# EasyEDA Pro project Connective.eprj, board PCB1
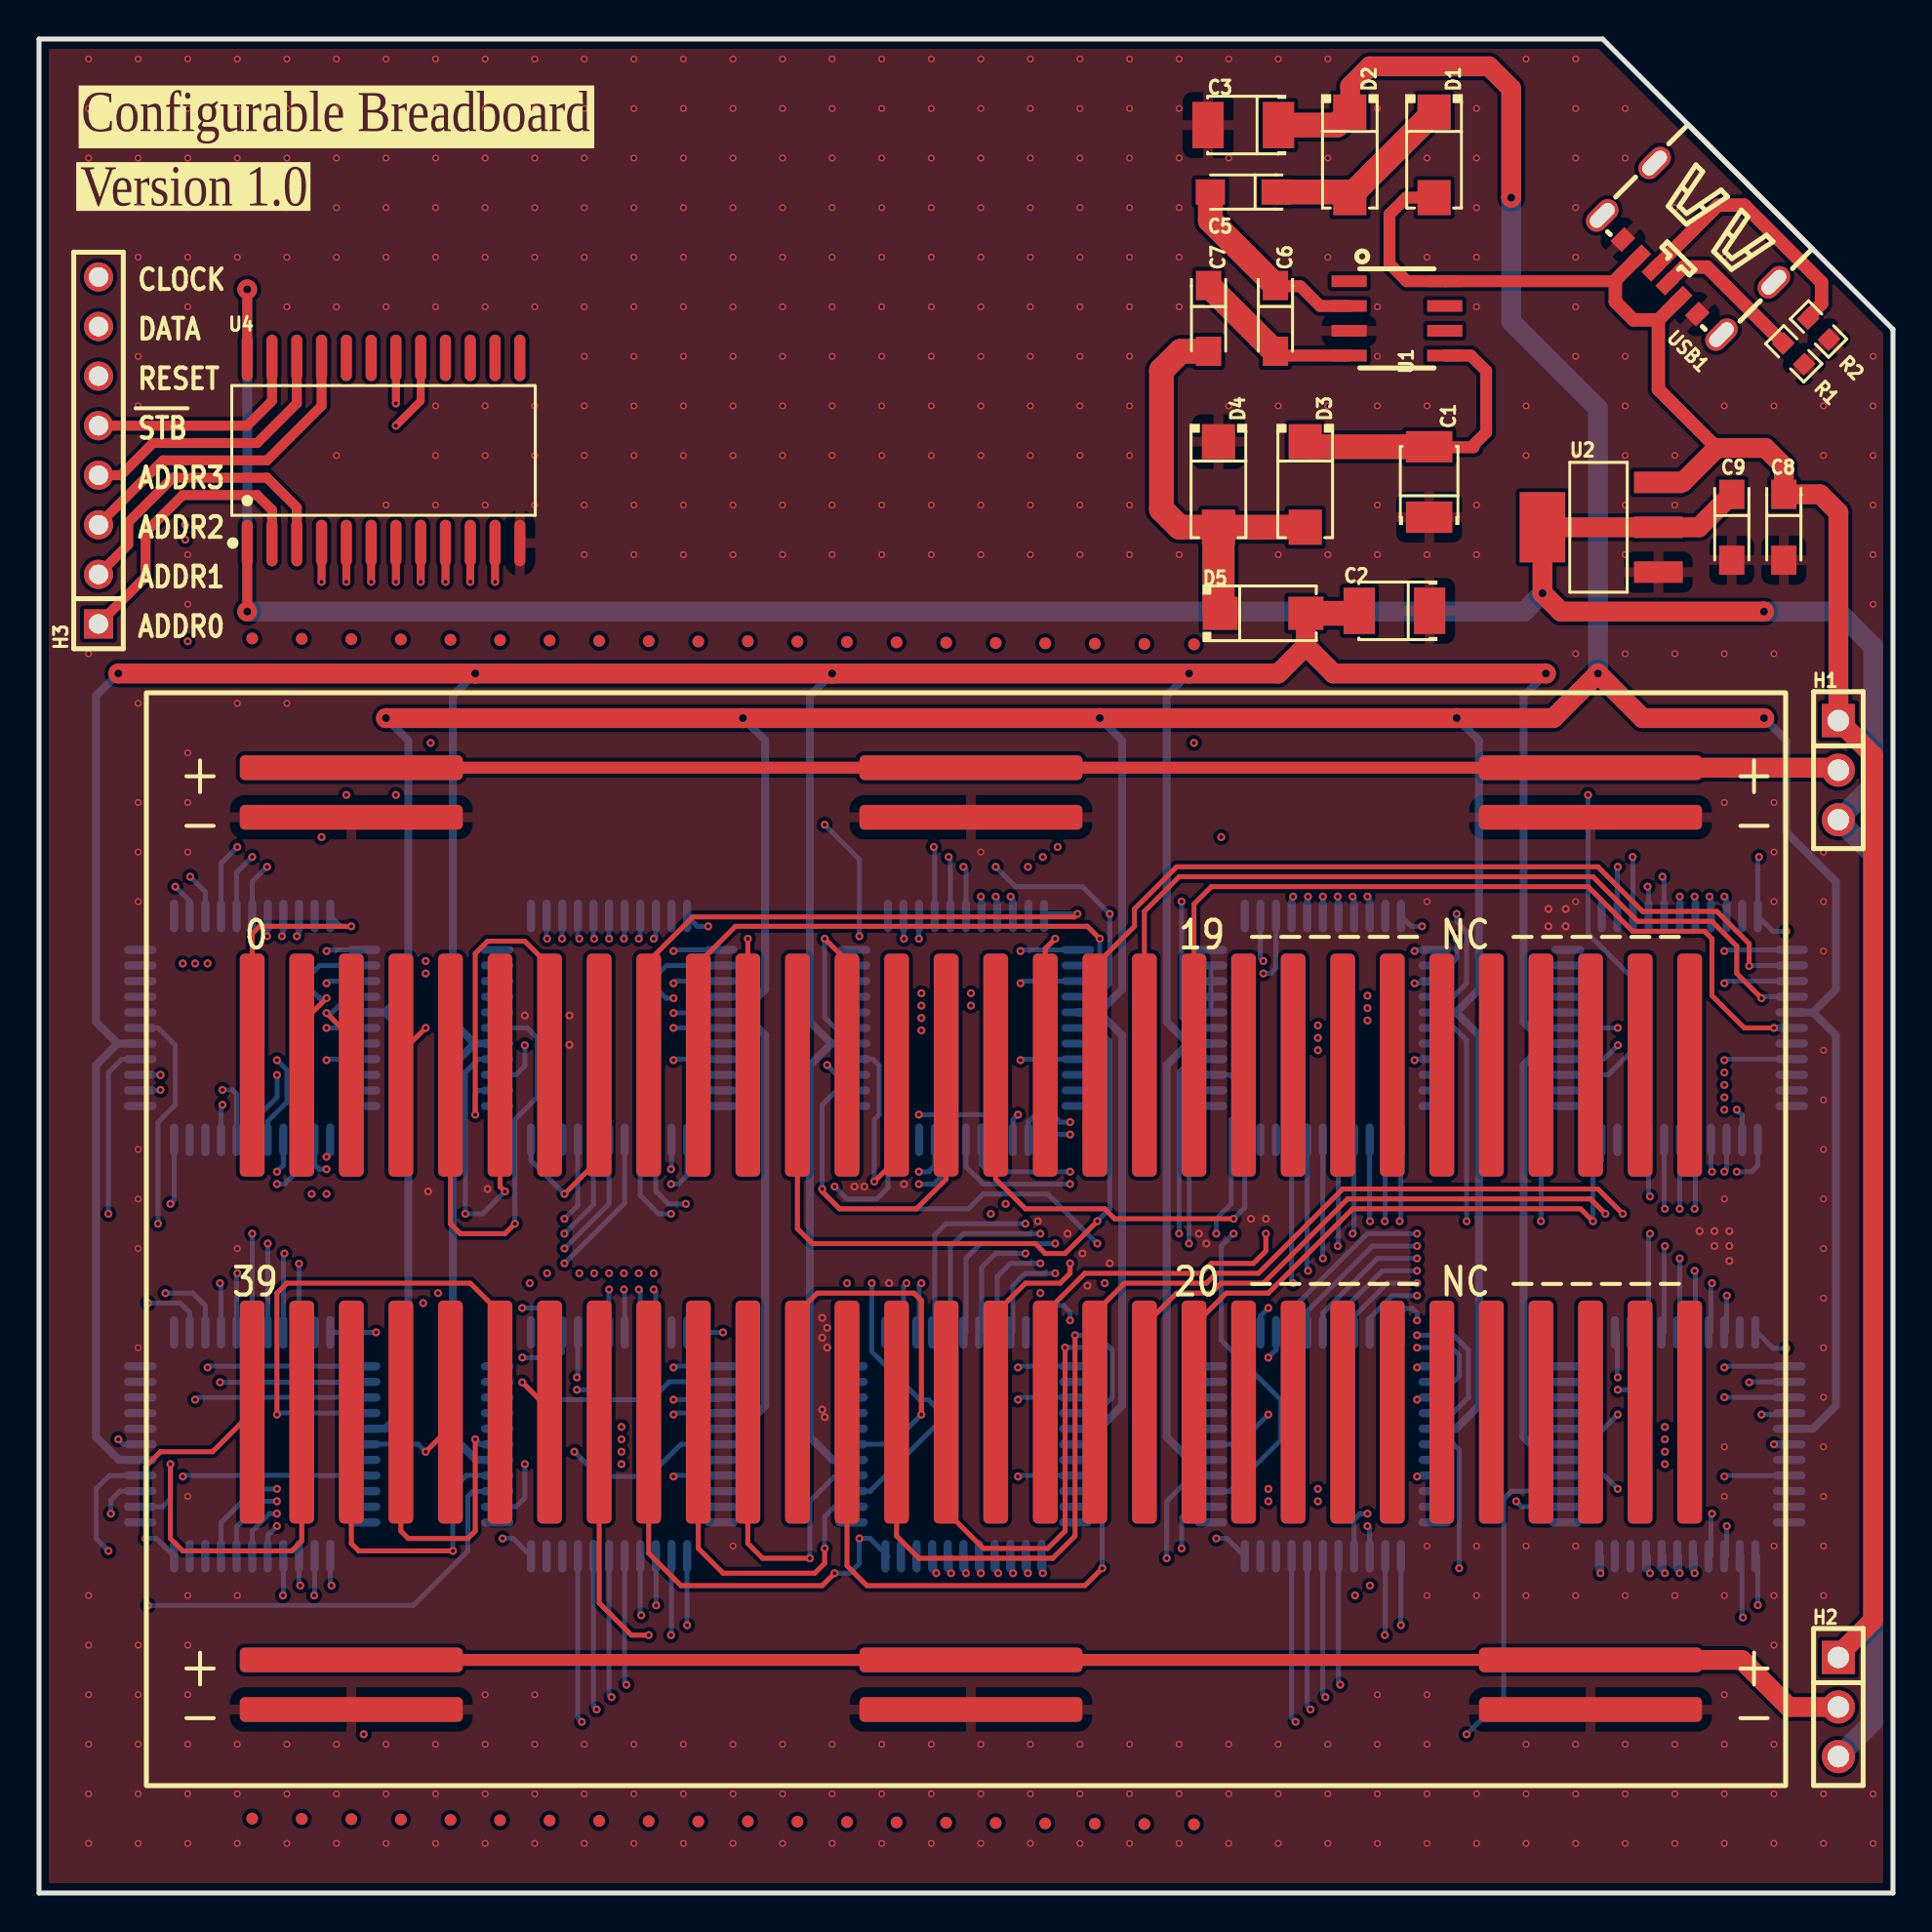
[diagram p1: board, top side]
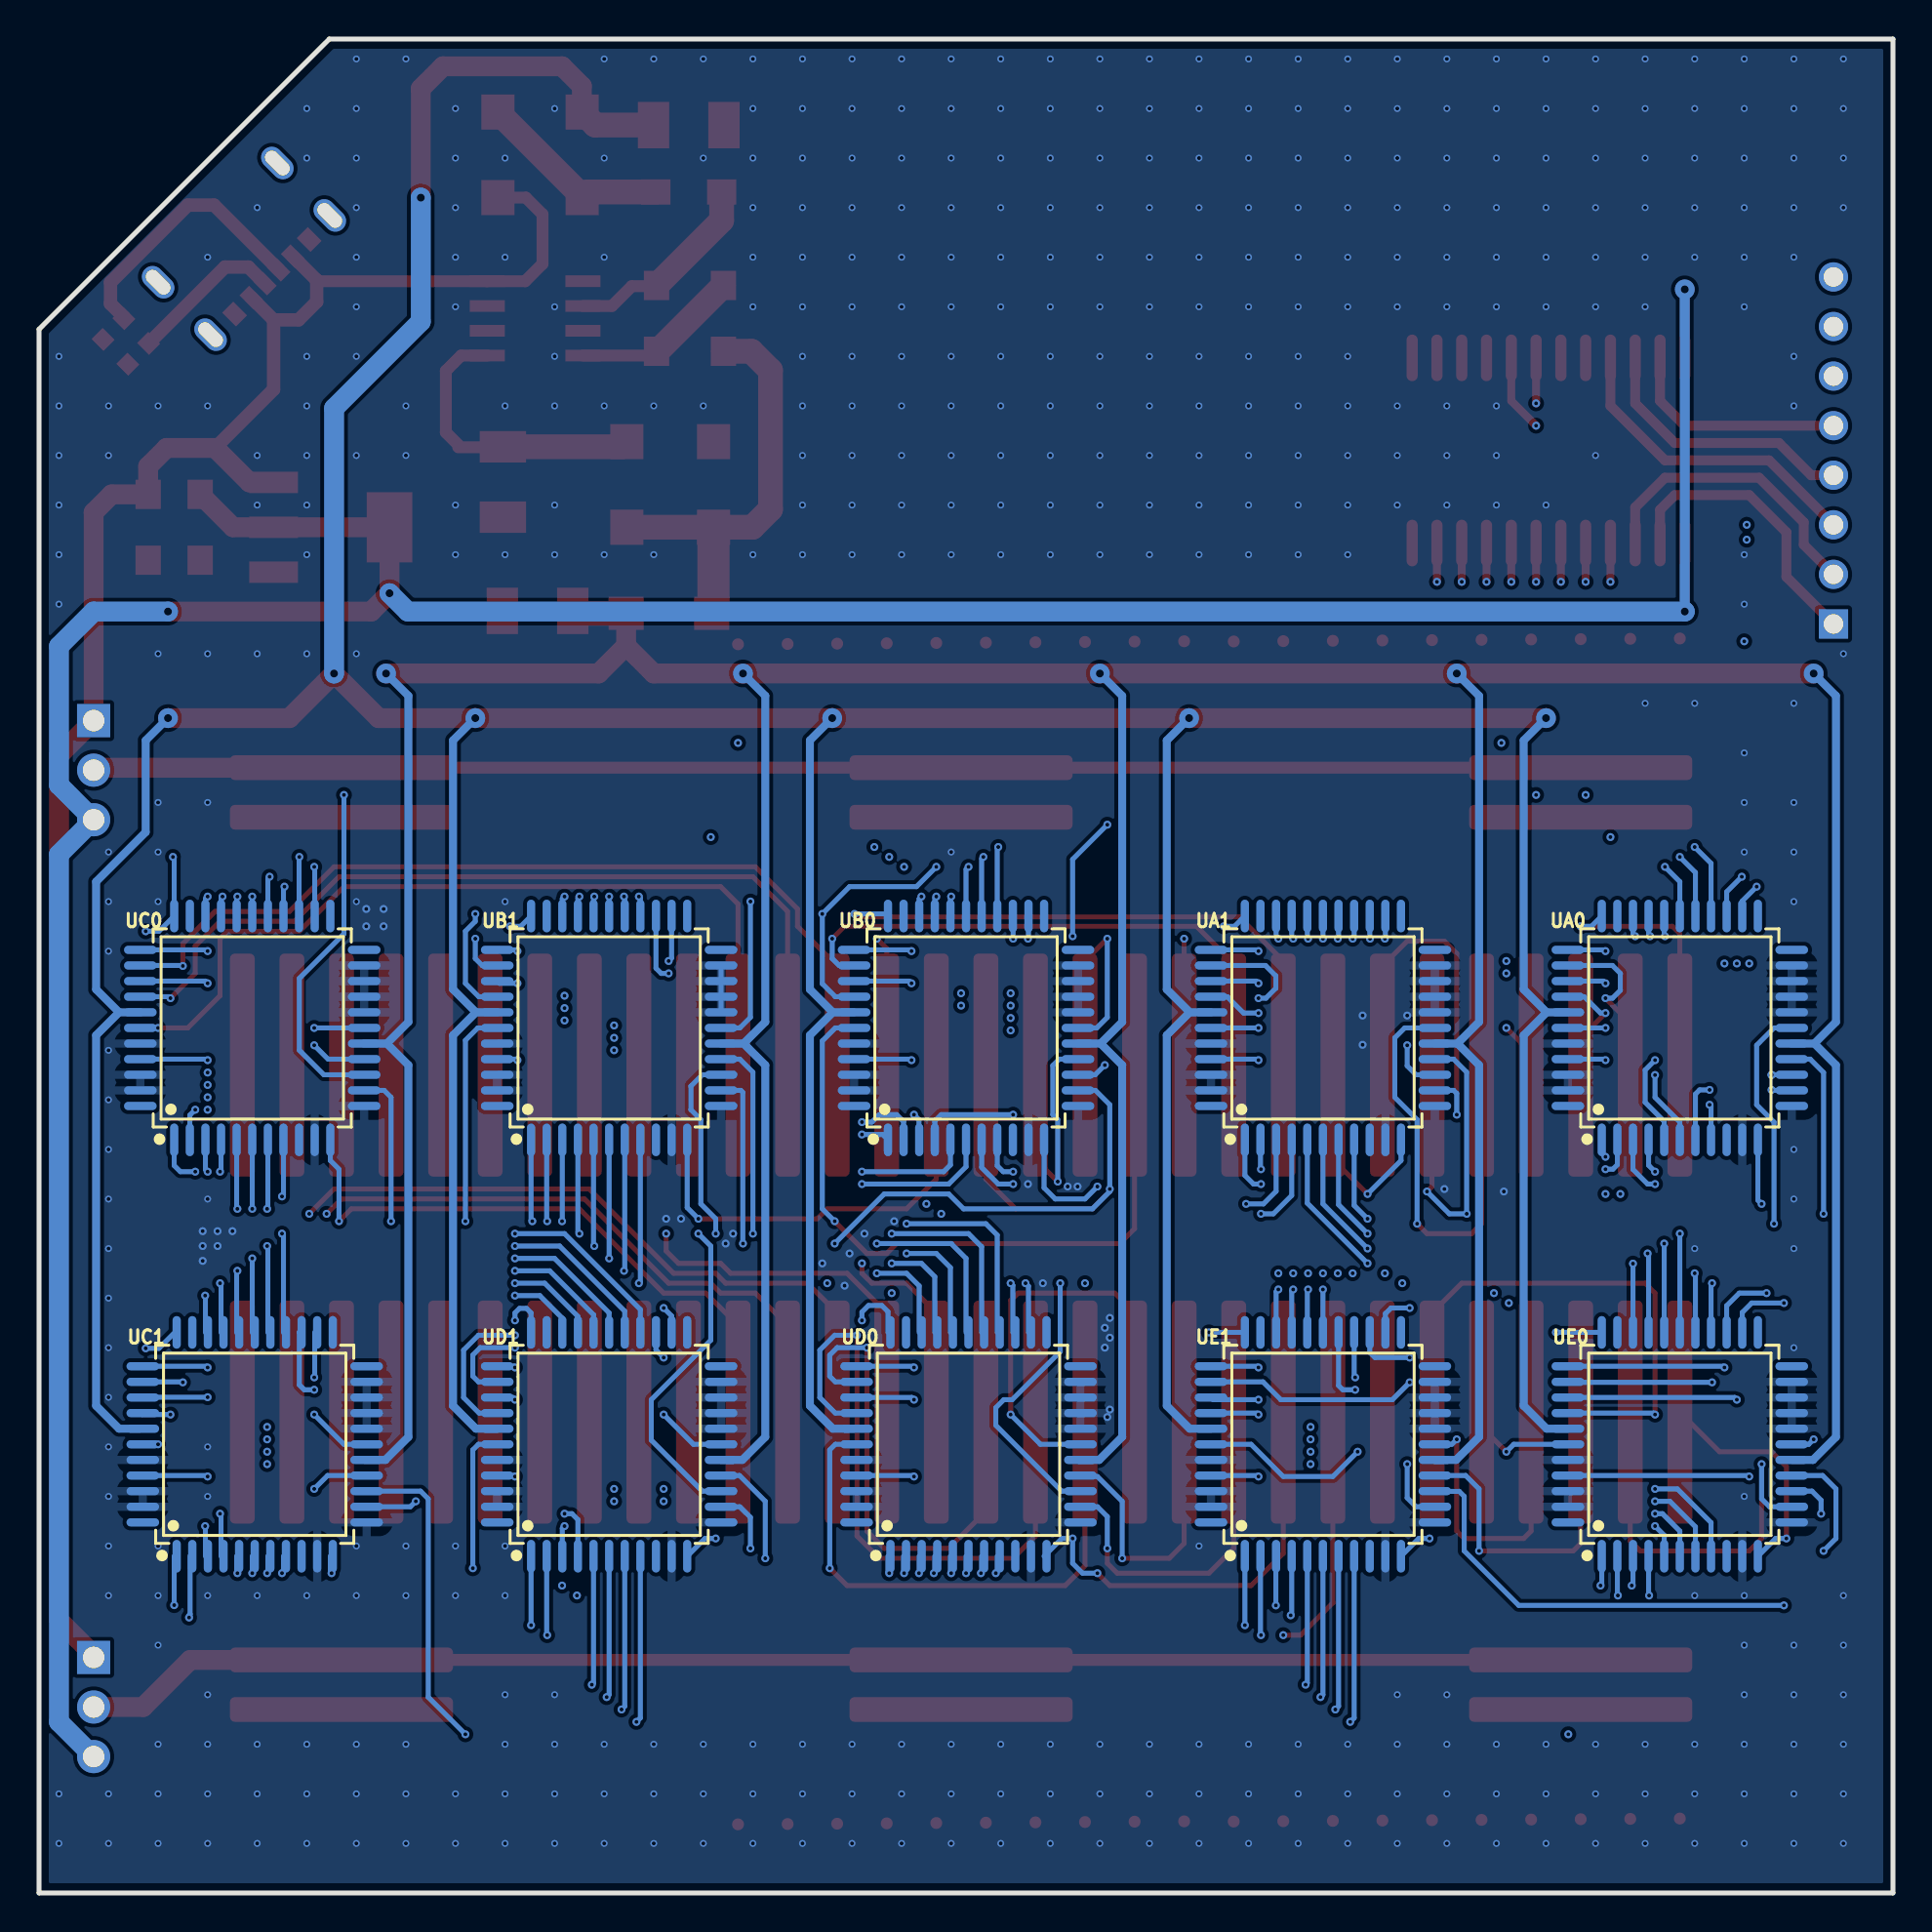
[diagram p2: board, bottom side, seen from below]

Outline 95 x 95 mm; copper layers: Top Layer, Inner1, Inner2, Bottom Layer. Coordinates in mm from the lower left corner of the outline.
Outline path: 0,95 0,0 95,0 95,80.12 80.12,95 0,95
Stack: Top Layer 0.035mm 外层铜厚1oz / Dielectric1 0.2104mm 7628 RC49% 8.6mil / Inner1 0.0152mm 内层铜厚 / Dielectric2 1.065mm 1.1mm H/HOZ 含铜 / Inner2 0.0152mm 内层铜厚 / Dielectric3 0.2104mm 7628 RC49% 8.6mil / Bottom Layer 0.035mm 外层铜厚1oz

## Design rules (mm)
template: 自定义配置
spacing copperThickness1oz (default): track to track 0.102, other pairs 0.152 to 0.3
spacing copperThickness2oz: track to track 0.203, other pairs 0.152 to 0.3
track width copperThickness1oz (default): min 0.127, default 0.254, max 2.54
track width copperThickness2oz: min 0.203, default 0.254, max 2.54
differential pair differentialPair (default): width min 0.127, default 0.254, max 2.54; gap min 0.152, default 0.152
via viaSize (default): diameter min 0.254, default 0.356, max 10; hole min 0.203, default 0.203, max 6.299

## Placement (name value [footprint] x y rotation side)
C1  100uF  [CAP-SMD_L3.5-W2.8]  71.23 72.3 270 top
C2  100uF  [CAP-SMD_L3.5-W2.8]  69.45 65.7 0 top
C3  100uF  [CAP-SMD_L3.5-W2.8]  61.71 90.59 0 top
C5  10uF  [CAP-SMD_L3.2-W1.6-RD]  61.71 87.16 180 top
C6  10uF  [CAP-SMD_L3.2-W1.6-RD]  63.36 80.69 270 top
C7  10uF  [CAP-SMD_L3.2-W1.6-RD]  59.93 80.69 270 top
C8  10uF  [CAP-SMD_L3.2-W1.6-RD]  89.41 69.98 270 top
C9  10uF  [CAP-SMD_L3.2-W1.6-RD]  86.74 69.98 270 top
D1  1N5819  [SMA_L4.4-W2.6-LS5.0-RD]  71.49 89.07 270 top
D2  1N5819  [SMA_L4.4-W2.6-LS5.0-RD]  67.17 89.07 270 top
D3  1N5819  [SMA_L4.4-W2.6-LS5.0-RD]  64.88 72.18 270 top
D4  1N5819  [SMA_L4.4-W2.6-LS5.0-RD]  60.44 72.18 270 top
D5  1N5819  [SMA_L4.4-W2.6-LS5.0-RD]  62.72 65.57 0 top
H1  PZ254V-11-03P  [HDR-TH_3P-P2.54-V-M]  92.2 57.53 270 top
H2  PZ254V-11-03P  [HDR-TH_3P-P2.54-V-M]  92.2 9.53 270 top
H3  PZ254V-11-08P  [HDR-TH_8P-P2.54-V-M]  3.05 73.92 90 top
NOREF  -  [Pad_e109]  23.62 3.73 0 top
NOREF#2  -  [Pad_e624]  33.78 24.64 180 top
NOREF#3  -  [Pad_e619]  46.48 24.64 180 top
NOREF#4  -  [Pad_e639]  16 9.4 90 top
NOREF#5  -  [Pad_e84]  51.56 3.57 0 top
NOREF#6  -  [Pad_e587]  51.56 42.42 0 top
NOREF#7  -  [Pad_e638]  47.75 57.66 90 top
NOREF#8  -  [Pad_e34]  10.92 64.28 0 top
NOREF#9  -  [Pad_e611]  13.46 24.64 180 top
NOREF#10  -  [Pad_e134]  13.46 3.8 0 top
NOREF#11  -  [Pad_e76]  56.64 3.53 0 top
NOREF#12  -  [Pad_e39]  18.54 64.23 0 top
NOREF#13  -  [Pad_e568]  13.46 42.42 0 top
NOREF#14  -  [Pad_e634]  79.5 57.66 90 top
NOREF#15  -  [Pad_e597]  76.96 42.42 0 top
NOREF#16  -  [Pad_e111]  18.54 3.76 0 top
NOREF#17  -  [Pad_e86]  49.02 3.58 0 top
NOREF#18  -  [Pad_e40]  21.08 64.21 0 top
NOREF#19  -  [Pad_e621]  38.86 24.64 180 top
NOREF#20  -  [Pad_e640]  16 11.94 90 top
NOREF#21  -  [Pad_e588]  56.64 42.42 0 top
NOREF#22  -  [Pad_e605]  71.88 24.64 0 top
NOREF#23  -  [Pad_e602]  64.26 24.64 0 top
NOREF#24  -  [Pad_e133]  16 3.78 0 top
NOREF#25  -  [Pad_e580]  33.78 42.42 0 top
NOREF#26  -  [Pad_e87]  46.48 3.6 0 top
NOREF#27  -  [Pad_e632]  16 57.66 90 top
NOREF#28  -  [Pad_e592]  64.26 42.42 0 top
NOREF#29  -  [Pad_e582]  38.86 42.42 0 top
NOREF#30  -  [Pad_e57]  43.94 64.09 0 top
NOREF#31  -  [Pad_e59]  38.86 64.12 0 top
NOREF#32  -  [Pad_e77]  54.1 3.55 0 top
NOREF#33  -  [Pad_e579]  28.7 42.42 0 top
NOREF#34  -  [Pad_e52]  54.1 64.02 0 top
NOREF#35  -  [Pad_e625]  31.24 24.64 180 top
NOREF#36  -  [Pad_e45]  33.78 64.13 0 top
NOREF#37  -  [Pad_e35]  13.46 64.27 0 top
NOREF#38  -  [Pad_e623]  36.32 24.64 180 top
NOREF#39  -  [Pad_e618]  49.02 24.64 180 top
NOREF#40  -  [Pad_e627]  28.7 24.64 180 top
NOREF#41  -  [Pad_e630]  18.54 24.64 180 top
NOREF#42  -  [Pad_e614]  59.18 24.64 180 top
NOREF#43  -  [Pad_e50]  56.64 64 0 top
NOREF#44  -  [Pad_e604]  66.8 24.64 0 top
NOREF#45  -  [Pad_e642]  79.5 11.94 90 top
NOREF#46  -  [Pad_e612]  16 24.64 180 top
NOREF#47  -  [Pad_e600]  84.58 42.42 0 top
NOREF#48  -  [Pad_e620]  43.94 24.64 180 top
NOREF#49  -  [Pad_e589]  54.1 42.42 0 top
NOREF#50  -  [Pad_e60]  36.32 64.14 0 top
NOREF#51  -  [Pad_e42]  26.16 64.18 0 top
NOREF#52  -  [Pad_e617]  54.1 24.64 180 top
NOREF#53  -  [Pad_e607]  76.96 24.64 0 top
NOREF#54  -  [Pad_e581]  36.32 42.42 0 top
NOREF#55  -  [Pad_e590]  59.18 42.42 0 top
NOREF#56  -  [Pad_e110]  21.08 3.75 0 top
NOREF#57  -  [Pad_e591]  61.72 42.42 0 top
NOREF#58  -  [Pad_e615]  56.64 24.64 180 top
NOREF#59  -  [Pad_e577]  26.16 42.42 0 top
NOREF#60  -  [Pad_e102]  33.78 3.66 0 top
NOREF#61  -  [Pad_e58]  41.4 64.11 0 top
NOREF#62  -  [Pad_e37]  16 64.25 0 top
NOREF#63  -  [Pad_e569]  16 42.42 0 top
NOREF#64  -  [Pad_e637]  47.75 55.12 90 top
NOREF#65  -  [Pad_e98]  41.4 3.64 0 top
NOREF#66  -  [Pad_e43]  28.7 64.16 0 top
NOREF#67  -  [Pad_e606]  74.42 24.64 0 top
NOREF#68  -  [Pad_e44]  31.24 64.15 0 top
NOREF#69  -  [Pad_e103]  31.24 3.68 0 top
NOREF#70  -  [Pad_e566]  10.92 42.42 0 top
NOREF#71  -  [Pad_e100]  38.86 3.65 0 top
NOREF#72  -  [Pad_e108]  26.16 3.71 0 top
NOREF#73  -  [Pad_e584]  41.4 42.42 0 top
NOREF#74  -  [Pad_e644]  47.75 11.94 90 top
NOREF#75  -  [Pad_e575]  21.08 42.42 0 top
NOREF#76  -  [Pad_e610]  84.58 24.64 0 top
NOREF#77  -  [Pad_e628]  23.62 24.64 180 top
NOREF#78  -  [Pad_e598]  82.04 42.42 0 top
NOREF#79  -  [Pad_e89]  43.94 3.62 0 top
NOREF#80  -  [Pad_e101]  36.32 3.67 0 top
NOREF#81  -  [Pad_e75]  59.18 3.52 0 top
NOREF#82  -  [Pad_e74]  59.18 63.98 0 top
NOREF#83  -  [Pad_e576]  23.62 42.42 0 top
NOREF#84  -  [Pad_e616]  51.56 24.64 180 top
NOREF#85  -  [Pad_e622]  41.4 24.64 180 top
NOREF#86  -  [Pad_e643]  47.75 9.4 90 top
NOREF#87  -  [Pad_e570]  18.54 42.42 0 top
NOREF#88  -  [Pad_e594]  66.8 42.42 0 top
NOREF#89  -  [Pad_e599]  79.5 42.42 0 top
NOREF#90  -  [Pad_e613]  10.92 24.64 180 top
NOREF#91  -  [Pad_e586]  49.02 42.42 0 top
NOREF#92  -  [Pad_e56]  46.48 64.07 0 top
NOREF#93  -  [Pad_e626]  26.16 24.64 180 top
NOREF#94  -  [Pad_e609]  79.5 24.64 0 top
NOREF#95  -  [Pad_e631]  16 55.12 90 top
NOREF#96  -  [Pad_e641]  79.5 9.4 90 top
NOREF#97  -  [Pad_e596]  74.42 42.42 0 top
NOREF#98  -  [Pad_e593]  69.34 42.42 0 top
NOREF#99  -  [Pad_e41]  23.62 64.2 0 top
NOREF#100  -  [Pad_e583]  43.94 42.42 0 top
NOREF#101  -  [Pad_e629]  21.08 24.64 180 top
NOREF#102  -  [Pad_e104]  28.7 3.69 0 top
NOREF#103  -  [Pad_e585]  46.48 42.42 0 top
NOREF#104  -  [Pad_e53]  51.56 64.04 0 top
NOREF#105  -  [Pad_e595]  71.88 42.42 0 top
NOREF#106  -  [Pad_e135]  10.92 3.81 0 top
NOREF#107  -  [Pad_e601]  61.72 24.64 0 top
NOREF#108  -  [Pad_e603]  69.34 24.64 0 top
NOREF#109  -  [Pad_e608]  82.04 24.64 0 top
NOREF#110  -  [Pad_e633]  79.5 55.12 90 top
NOREF#111  -  [Pad_e578]  31.24 42.42 0 top
NOREF#112  -  [Pad_e55]  49.02 64.05 0 top
R1  5.1kΩ  [R0603]  89.92 78.87 135 top
R2  5.1kΩ  [R0603]  91.19 80.14 135 top
U1  LT1054IS8#PBF  [SO-8_L4.9-W3.9-P1.27-LS6.0-BL]  69.58 80.69 270 top
U2  AMS1117-3.3  [SOT-223-3_L6.5-W3.4-P2.30-LS7.0-BR]  80.01 69.98 0 top
U4  74HC4514D,653  [SOIC-24_L15.4-W7.5-P1.27-LS10.3-BL]  17.65 73.92 0 top
UA0  CH446Q  [LQFP-44_L10.0-W10.0-P0.80-LS12.0-BL]  10.92 44.33 180 bottom
UA1  CH446Q  [LQFP-44_L10.0-W10.0-P0.80-LS12.0-BL]  29.21 44.33 180 bottom
UB0  CH446Q  [LQFP-44_L10.0-W10.0-P0.80-LS12.0-BL]  47.5 44.33 180 bottom
UB1  CH446Q  [LQFP-44_L10.0-W10.0-P0.80-LS12.0-BL]  65.79 44.33 180 bottom
UC0  CH446Q  [LQFP-44_L10.0-W10.0-P0.80-LS12.0-BL]  84.07 44.33 180 bottom
UC1  CH446Q  [LQFP-44_L10.0-W10.0-P0.80-LS12.0-BL]  83.95 22.99 180 bottom
UD0  CH446Q  [LQFP-44_L10.0-W10.0-P0.80-LS12.0-BL]  47.37 22.99 180 bottom
UD1  CH446Q  [LQFP-44_L10.0-W10.0-P0.80-LS12.0-BL]  65.79 22.99 180 bottom
UE0  CH446Q  [LQFP-44_L10.0-W10.0-P0.80-LS12.0-BL]  10.92 22.99 180 bottom
UE1  CH446Q  [LQFP-44_L10.0-W10.0-P0.80-LS12.0-BL]  29.21 22.99 180 bottom
USB1  TYPE-C 6P(073)  [TYPE-C-SMD_TYPE-C-6P]  84.46 84.2 135 top

## Footprints (pads in the part's own frame, mm; a bottom-side part is the same pattern mirrored in y, then rotated)
CAP-SMD_L3.2-W1.6-RD
  rect 1.5x1.296 smd: 1(-1.687,0) 2(1.687,0)
CAP-SMD_L3.5-W2.8
  rect 1.607x2.376 smd: 1(1.804,0) 2(-1.804,0)
HDR-TH_3P-P2.54-V-M
  rect 1.7x1.7 hole 1.1: 1(-2.54,0)
  round 1.7 hole 1.1: 2(0,0) 3(2.54,0)
HDR-TH_8P-P2.54-V-M
  rect 1.5x1.5 hole 1: 1(-8.89,0)
  round 1.5 hole 1: 2(-6.35,0) 3(-3.81,0) 4(-1.27,0) 5(1.27,0) 6(3.81,0) 7(6.35,0) 8(8.89,0)
LQFP-44_L10.0-W10.0-P0.80-LS12.0-BL
  oval 0.42x1.67 smd: 1(-4,-5.735) 2(-3.2,-5.735) 3(-2.4,-5.735) 4(-1.6,-5.735) 5(-0.8,-5.735) 6(0,-5.735) 7(0.8,-5.735) 8(1.6,-5.735) 9(2.4,-5.735) 10(3.2,-5.735) 11(4,-5.735) 23(4,5.735) 24(3.2,5.735) 25(2.4,5.735) 26(1.6,5.735) 27(0.8,5.735) 28(0,5.735) 29(-0.8,5.735) 30(-1.6,5.735) 31(-2.4,5.735) 32(-3.2,5.735) 33(-4,5.735)
  oval 1.67x0.42 smd: 12(5.735,-4) 13(5.735,-3.2) 14(5.735,-2.4) 15(5.735,-1.6) 16(5.735,-0.8) 17(5.735,0) 18(5.735,0.8) 19(5.735,1.6) 20(5.735,2.4) 21(5.735,3.2) 22(5.735,4) 34(-5.735,4) 35(-5.735,3.2) 36(-5.735,2.4) 37(-5.735,1.6) 38(-5.735,0.8) 39(-5.735,0) 40(-5.735,-0.8) 41(-5.735,-1.6) 42(-5.735,-2.4) 43(-5.735,-3.2) 44(-5.735,-4)
Pad_e34
  round 0.61 smd: TP3(0,0)
Pad_e35
  round 0.61 smd: TP4(0,0)
Pad_e37
  round 0.61 smd: TP4(0,0)
Pad_e39
  round 0.61 smd: TP4(0,0)
Pad_e40
  round 0.61 smd: TP4(0,0)
Pad_e41
  round 0.61 smd: TP4(0,0)
Pad_e42
  round 0.61 smd: TP4(0,0)
Pad_e43
  round 0.61 smd: TP4(0,0)
Pad_e44
  round 0.61 smd: TP4(0,0)
Pad_e45
  round 0.61 smd: TP4(0,0)
Pad_e50
  round 0.61 smd: TP4(0,0)
Pad_e52
  round 0.61 smd: TP4(0,0)
Pad_e53
  round 0.61 smd: TP4(0,0)
Pad_e55
  round 0.61 smd: TP4(0,0)
Pad_e56
  round 0.61 smd: TP4(0,0)
Pad_e57
  round 0.61 smd: TP4(0,0)
Pad_e58
  round 0.61 smd: TP4(0,0)
Pad_e59
  round 0.61 smd: TP4(0,0)
Pad_e60
  round 0.61 smd: TP3(0,0)
Pad_e74
  round 0.61 smd: TP4(0,0)
Pad_e75
  round 0.61 smd: TP4(0,0)
Pad_e76
  round 0.61 smd: TP4(0,0)
Pad_e77
  round 0.61 smd: TP4(0,0)
Pad_e84
  round 0.61 smd: TP4(0,0)
Pad_e86
  round 0.61 smd: TP4(0,0)
Pad_e87
  round 0.61 smd: TP4(0,0)
Pad_e89
  round 0.61 smd: TP4(0,0)
Pad_e98
  round 0.61 smd: TP4(0,0)
Pad_e100
  round 0.61 smd: TP4(0,0)
Pad_e101
  round 0.61 smd: TP3(0,0)
Pad_e102
  round 0.61 smd: TP4(0,0)
Pad_e103
  round 0.61 smd: TP4(0,0)
Pad_e104
  round 0.61 smd: TP4(0,0)
Pad_e108
  round 0.61 smd: TP4(0,0)
Pad_e109
  round 0.61 smd: TP4(0,0)
Pad_e110
  round 0.61 smd: TP4(0,0)
Pad_e111
  round 0.61 smd: TP4(0,0)
Pad_e133
  round 0.61 smd: TP4(0,0)
Pad_e134
  round 0.61 smd: TP4(0,0)
Pad_e135
  round 0.61 smd: TP3(0,0)
Pad_e566
  rrect 1.27x11.43 smd: 0(0,0)
Pad_e568
  rrect 1.27x11.43 smd: 1(0,0)
Pad_e569
  rrect 1.27x11.43 smd: 2(0,0)
Pad_e570
  rrect 1.27x11.43 smd: 3(0,0)
Pad_e575
  rrect 1.27x11.43 smd: 4(0,0)
Pad_e576
  rrect 1.27x11.43 smd: 5(0,0)
Pad_e577
  rrect 1.27x11.43 smd: 6(0,0)
Pad_e578
  rrect 1.27x11.43 smd: 8(0,0)
Pad_e579
  rrect 1.27x11.43 smd: 7(0,0)
Pad_e580
  rrect 1.27x11.43 smd: 9(0,0)
Pad_e581
  rrect 1.27x11.43 smd: 10(0,0)
Pad_e582
  rrect 1.27x11.43 smd: 11(0,0)
Pad_e583
  rrect 1.27x11.43 smd: 13(0,0)
Pad_e584
  rrect 1.27x11.43 smd: 12(0,0)
Pad_e585
  rrect 1.27x11.43 smd: 14(0,0)
Pad_e586
  rrect 1.27x11.43 smd: 15(0,0)
Pad_e587
  rrect 1.27x11.43 smd: 16(0,0)
Pad_e588
  rrect 1.27x11.43 smd: 18(0,0)
Pad_e589
  rrect 1.27x11.43 smd: 17(0,0)
Pad_e590
  rrect 1.27x11.43 smd: 19(0,0)
Pad_e591
  rrect 1.27x11.43 smd: NC(0,0)
Pad_e592
  rrect 1.27x11.43 smd: NC(0,0)
Pad_e593
  rrect 1.27x11.43 smd: NC(0,0)
Pad_e594
  rrect 1.27x11.43 smd: NC(0,0)
Pad_e595
  rrect 1.27x11.43 smd: NC(0,0)
Pad_e596
  rrect 1.27x11.43 smd: NC(0,0)
Pad_e597
  rrect 1.27x11.43 smd: NC(0,0)
Pad_e598
  rrect 1.27x11.43 smd: NC(0,0)
Pad_e599
  rrect 1.27x11.43 smd: NC(0,0)
Pad_e600
  rrect 1.27x11.43 smd: NC(0,0)
Pad_e601
  rrect 1.27x11.43 smd: NC(0,0)
Pad_e602
  rrect 1.27x11.43 smd: NC(0,0)
Pad_e603
  rrect 1.27x11.43 smd: NC(0,0)
Pad_e604
  rrect 1.27x11.43 smd: NC(0,0)
Pad_e605
  rrect 1.27x11.43 smd: NC(0,0)
Pad_e606
  rrect 1.27x11.43 smd: NC(0,0)
Pad_e607
  rrect 1.27x11.43 smd: NC(0,0)
Pad_e608
  rrect 1.27x11.43 smd: NC(0,0)
Pad_e609
  rrect 1.27x11.43 smd: NC(0,0)
Pad_e610
  rrect 1.27x11.43 smd: NC(0,0)
Pad_e611
  rrect 1.27x11.43 smd: 38(0,0)
Pad_e612
  rrect 1.27x11.43 smd: 37(0,0)
Pad_e613
  rrect 1.27x11.43 smd: 39(0,0)
Pad_e614
  rrect 1.27x11.43 smd: 20(0,0)
Pad_e615
  rrect 1.27x11.43 smd: 21(0,0)
Pad_e616
  rrect 1.27x11.43 smd: 23(0,0)
Pad_e617
  rrect 1.27x11.43 smd: 22(0,0)
Pad_e618
  rrect 1.27x11.43 smd: 24(0,0)
Pad_e619
  rrect 1.27x11.43 smd: 25(0,0)
Pad_e620
  rrect 1.27x11.43 smd: 26(0,0)
Pad_e621
  rrect 1.27x11.43 smd: 28(0,0)
Pad_e622
  rrect 1.27x11.43 smd: 27(0,0)
Pad_e623
  rrect 1.27x11.43 smd: 29(0,0)
Pad_e624
  rrect 1.27x11.43 smd: 30(0,0)
Pad_e625
  rrect 1.27x11.43 smd: 31(0,0)
Pad_e626
  rrect 1.27x11.43 smd: 33(0,0)
Pad_e627
  rrect 1.27x11.43 smd: 32(0,0)
Pad_e628
  rrect 1.27x11.43 smd: 34(0,0)
Pad_e629
  rrect 1.27x11.43 smd: 35(0,0)
Pad_e630
  rrect 1.27x11.43 smd: 36(0,0)
Pad_e631
  rrect 1.27x11.43 smd: 41(0,0)
Pad_e632
  rrect 1.27x11.43 smd: 40(0,0)
Pad_e633
  rrect 1.27x11.43 smd: 45(0,0)
Pad_e634
  rrect 1.27x11.43 smd: 44(0,0)
Pad_e637
  rrect 1.27x11.43 smd: 43(0,0)
Pad_e638
  rrect 1.27x11.43 smd: 42(0,0)
Pad_e639
  rrect 1.27x11.43 smd: 47(0,0)
Pad_e640
  rrect 1.27x11.43 smd: 46(0,0)
Pad_e641
  rrect 1.27x11.43 smd: 51(0,0)
Pad_e642
  rrect 1.27x11.43 smd: 50(0,0)
Pad_e643
  rrect 1.27x11.43 smd: 49(0,0)
Pad_e644
  rrect 1.27x11.43 smd: 48(0,0)
R0603
  rect 0.806x0.864 smd: 1(-0.753,0) 2(0.753,0)
SMA_L4.4-W2.6-LS5.0-RD
  rect 1.8x1.7 smd: 1(-2.192,0) 2(2.192,0)
SO-8_L4.9-W3.9-P1.27-LS6.0-BL
  rect 0.6x1.8 smd: 1(-1.905,-2.45) 2(-0.635,-2.45) 3(0.635,-2.45) 4(1.905,-2.45) 5(1.905,2.45) 6(0.635,2.45) 7(-0.635,2.45) 8(-1.905,2.45)
SOIC-24_L15.4-W7.5-P1.27-LS10.3-BL
  oval 0.574x2.388 smd: 1(-6.985,-4.744) 2(-5.715,-4.744) 3(-4.445,-4.744) 4(-3.175,-4.744) 5(-1.905,-4.744) 6(-0.635,-4.744) 7(0.635,-4.744) 8(1.905,-4.744) 9(3.175,-4.744) 10(4.445,-4.744) 11(5.715,-4.744) 12(6.985,-4.744) 13(6.985,4.744) 14(5.715,4.744) 15(4.445,4.744) 16(3.175,4.744) 17(1.905,4.744) 18(0.635,4.744) 19(-0.635,4.744) 20(-1.905,4.744) 21(-3.175,4.744) 22(-4.445,4.744) 23(-5.715,4.744) 24(-6.985,4.744)
SOT-223-3_L6.5-W3.4-P2.30-LS7.0-BR
  rect 2.5x1.1 smd: 1(2.97,-2.3) 2(2.97,0) 3(2.97,2.3)
  rect 2.34x3.6 smd: 4(-2.97,0)
TYPE-C-SMD_TYPE-C-6P
  oval 1.1x1.9 hole 0.7x1.5: 7(-4.32,1.837) 7(-4.32,-1.962) 7(4.32,1.837) 7(4.32,-1.962)
  rect 0.7x1 smd: A5(-0.5,1.962) A9(1.5,1.962) B5(0.5,1.962) B9(-1.5,1.962)
  rect 0.8x1 smd: A12(2.7,1.962) B12(-2.7,1.962)

## Nets
+3V3: C9.1 H1.3 H2.3 U2.2 U2.4 U4.1 U4.24
+5V: C8.1 D1.2 H1.1 H2.1 U1.8 U2.3 USB1.A9 USB1.B9
GND: C1.1 C2.1 C3.2 C8.2 C9.2 D4.1 NOREF#4.47 NOREF#64.43 NOREF#86.49 NOREF#95.41 NOREF#96.51 NOREF#110.45 R1.1 R2.1 U1.3 U2.1 U4.12 UA0.10 UA0.12 UA0.18 UA0.19 UA0.20 UA0.21 UA0.40 UA0.42 UA0.43 UA1.10 UA1.12 UA1.18 UA1.19 UA1.20 UA1.21 UA1.40 UA1.42 UA1.43 UB0.10 UB0.12 UB0.18 UB0.19 UB0.20 UB0.21 UB0.40 UB0.42 UB0.43 UB1.10 UB1.12 UB1.18 UB1.19 UB1.20 UB1.21 UB1.40 UB1.42 UB1.43 UC0.10 UC0.12 UC0.18 UC0.19 UC0.20 UC0.21 UC0.40 UC0.42 UC0.43 UC1.10 UC1.12 UC1.18 UC1.19 UC1.20 UC1.21 UC1.40 UC1.42 UC1.43 UD0.10 UD0.12 UD0.18 UD0.19 UD0.20 UD0.21 UD0.40 UD0.42 UD0.43 UD1.10 UD1.12 UD1.18 UD1.19 UD1.20 UD1.21 UD1.40 UD1.42 UD1.43 UE0.10 UE0.12 UE0.18 UE0.19 UE0.20 UE0.21 UE0.40 UE0.42 UE0.43 UE1.10 UE1.12 UE1.18 UE1.19 UE1.20 UE1.21 UE1.40 UE1.42 UE1.43 USB1.A12 USB1.B12
VDD: C3.1 D2.1 UA0.38 UA1.38 UB0.38 UB1.38 UC0.38 UC1.38 UD0.38 UD1.38 UE0.38 UE1.38
VEE: C2.2 D5.2 UA0.16 UA1.16 UB0.16 UB1.16 UC0.16 UC1.16 UD0.16 UD1.16 UE0.16 UE1.16
0: NOREF#8.TP3 NOREF#70.0 UA0.33 UA1.33
1: NOREF#13.1 NOREF#37.TP4 UA0.35 UA1.35
2: NOREF#62.TP4 NOREF#63.2 UA0.37 UA1.37
3: NOREF#12.TP4 NOREF#87.3 UA0.39 UA1.39
4: NOREF#18.TP4 NOREF#75.4 UA0.17 UA1.17
5: NOREF#83.5 NOREF#99.TP4 UA0.15 UA1.15
6: NOREF#51.TP4 NOREF#59.6 UA0.13 UA1.13
7: NOREF#33.7 NOREF#66.TP4 UA0.11 UA1.11
8: NOREF#68.TP4 NOREF#111.8 UB0.33 UB1.33
9: NOREF#25.9 NOREF#36.TP4 UB0.35 UB1.35
10: NOREF#50.TP3 NOREF#54.10 UB0.37 UB1.37
11: NOREF#29.11 NOREF#31.TP4 UB0.39 UB1.39
12: NOREF#61.TP4 NOREF#73.12 UB0.17 UB1.17
13: NOREF#30.TP4 NOREF#100.13 UB0.15 UB1.15
14: NOREF#92.TP4 NOREF#103.14 UB0.13 UB1.13
15: NOREF#91.15 NOREF#112.TP4 UB0.11 UB1.11
16: NOREF#6.16 NOREF#104.TP4 UC0.33 UC1.33
17: NOREF#34.TP4 NOREF#49.17 UC0.35 UC1.35
18: NOREF#21.18 NOREF#43.TP4 UC0.37 UC1.37
19: NOREF#55.19 NOREF#82.TP4 UC0.39 UC1.39
20: NOREF#42.20 NOREF#81.TP4 UC0.11 UC1.11
21: NOREF#11.TP4 NOREF#58.21 UC0.17 UC1.17
22: NOREF#32.TP4 NOREF#52.22 UC0.15 UC1.15
23: NOREF#5.TP4 NOREF#84.23 UC0.13 UC1.13
24: NOREF#17.TP4 NOREF#39.24 UD0.33 UD1.33
25: NOREF#3.25 NOREF#26.TP4 UD0.35 UD1.35
26: NOREF#48.26 NOREF#79.TP4 UD0.37 UD1.37
27: NOREF#65.TP4 NOREF#85.27 UD0.39 UD1.39
28: NOREF#19.28 NOREF#71.TP4 UD0.17 UD1.17
29: NOREF#38.29 NOREF#80.TP3 UD0.15 UD1.15
30: NOREF#2.30 NOREF#60.TP4 UD0.13 UD1.13
31: NOREF#35.31 NOREF#69.TP4 UD0.11 UD1.11
32: NOREF#40.32 NOREF#102.TP4 UE0.33 UE1.33
33: NOREF#72.TP4 NOREF#93.33 UE0.35 UE1.35
34: NOREF.TP4 NOREF#77.34 UE0.37 UE1.37
35: NOREF#56.TP4 NOREF#101.35 UE0.39 UE1.39
36: NOREF#16.TP4 NOREF#41.36 UE0.17 UE1.17
37: NOREF#24.TP4 NOREF#46.37 UE0.15 UE1.15
38: NOREF#9.38 NOREF#10.TP4 UE0.13 UE1.13
39: NOREF#90.39 NOREF#106.TP3 UE0.11 UE1.11
AB0: UA0.31 UB0.31
AB1: UA0.30 UB0.30
AB2: UA0.29 UB0.29
AB3: UA0.28 UB0.28
AB4: UA0.27 UB0.27
AB5: UA0.26 UB0.26
AB6: UA0.3 UB0.3
AB7: UA0.4 UB0.4
AC0: UA0.5 UC0.31
AC1: UA0.6 UC0.30
AC2: UA0.7 UC0.29
AC3: UA0.8 UC0.28
AC4: UA0.25 UC0.27
AC5: UA0.24 UC0.26
AC6: UA0.1 UC0.3
AC7: UA0.2 UC0.4
AD0: UA1.31 UD0.31
AD1: UA1.30 UD0.30
AD2: UA1.29 UD0.29
AD3: UA1.28 UD0.28
AD4: UA1.27 UD0.27
AD5: UA1.26 UD0.26
AD6: UA1.3 UD0.3
AD7: UA1.4 UD0.4
AE0: UA1.5 UE0.31
AE1: UA1.6 UE0.30
AE2: UA1.7 UE0.29
AE3: UA1.8 UE0.28
AE4: UA1.25 UE0.27
AE5: UA1.24 UE0.26
AE6: UA1.1 UE0.3
AE7: UA1.2 UE0.4
BC0: UB0.5 UC0.5
BC1: UB0.6 UC0.6
BC2: UB0.7 UC0.7
BC3: UB0.8 UC0.8
BC4: UB0.25 UC0.25
BC5: UB0.24 UC0.24
BC6: UB0.1 UC0.1
BC7: UB0.2 UC0.2
BD0: UB1.31 UD0.5
BD1: UB1.30 UD0.6
BD2: UB1.29 UD0.7
BD3: UB1.28 UD0.8
BD4: UB1.27 UD0.25
BD5: UB1.26 UD0.24
BD6: UB1.3 UD0.1
BD7: UB1.4 UD0.2
BE0: UB1.5 UE0.5
BE1: UB1.6 UE0.6
BE2: UB1.7 UE0.7
BE3: UB1.8 UE0.8
BE4: UB1.25 UE0.25
BE5: UB1.24 UE0.24
BE6: UB1.1 UE0.1
BE7: UB1.2 UE0.2
BOTTOM_RAIL: H2.2 NOREF#20.46 NOREF#45.50 NOREF#74.48
CD0: UC1.31 UD1.31
CD1: UC1.30 UD1.30
CD2: UC1.29 UD1.29
CD3: UC1.28 UD1.28
CD4: UC1.27 UD1.27
CD5: UC1.26 UD1.26
CD6: UC1.3 UD1.3
CD7: UC1.4 UD1.4
CE0: UC1.5 UE1.31
CE1: UC1.6 UE1.30
CE2: UC1.7 UE1.29
CE3: UC1.8 UE1.28
CE4: UC1.25 UE1.27
CE5: UC1.24 UE1.26
CE6: UC1.1 UE1.3
CE7: UC1.2 UE1.4
CLOCK: H3.8 UA0.34 UA1.34 UB0.34 UB1.34 UC0.34 UC1.34 UD0.34 UD1.34 UE0.34 UE1.34
CS_ADDR0: H3.1 U4.2
CS_ADDR1: H3.2 U4.3
CS_ADDR2: H3.3 U4.21
CS_ADDR3: H3.4 U4.22
DATA: H3.7 UA0.36 UA1.36 UB0.36 UB1.36 UC0.36 UC1.36 UD0.36 UD1.36 UE0.36 UE1.36
DE0: UD1.5 UE1.5
DE1: UD1.6 UE1.6
DE2: UD1.7 UE1.7
DE3: UD1.8 UE1.8
DE4: UD1.25 UE1.25
DE5: UD1.24 UE1.24
DE6: UD1.1 UE1.1
DE7: UD1.2 UE1.2
RESET: H3.6 UA0.41 UA1.41 UB0.41 UB1.41 UC0.41 UC1.41 UD0.41 UD1.41 UE0.41 UE1.41
STB#: H3.5 U4.23
STB_A0: U4.11 UA0.14
STB_A1: U4.9 UA1.14
STB_B0: U4.10 UB0.14
STB_B1: U4.8 UB1.14
STB_C0: U4.7 UC0.14
STB_C1: U4.6 UC1.14
STB_D0: U4.5 UD0.14
STB_D1: U4.4 UD1.14
STB_E0: U4.18 UE0.14
STB_E1: U4.17 UE1.14
TOP_RAIL: H1.2 NOREF#7.42 NOREF#14.44 NOREF#27.40
$1N2223: C5.1 D1.1 D2.2
$1N2564: C1.2 D3.1 U1.5
$1N2990: C5.2 C6.1 U1.2
$1N3088: C6.2 C7.1 U1.4
$1N3099: C7.2 D3.2 D4.2 D5.1
$1N5240: R1.2 USB1.A5
$1N5279: R2.2 USB1.B5

Pads without a net: NOREF#15 NC; NOREF#22 NC; NOREF#23 NC; NOREF#28 NC; NOREF#44 NC; NOREF#47 NC; NOREF#53 NC; NOREF#57 NC; NOREF#67 NC; NOREF#76 NC; NOREF#78 NC; NOREF#88 NC; NOREF#89 NC; NOREF#94 NC; NOREF#97 NC; NOREF#98 NC; NOREF#105 NC; NOREF#107 NC; NOREF#108 NC; NOREF#109 NC; U1 1 6 7; U4 13 14 15 16 19 20; UA0 9 22 23 32 44; UA1 9 22 23 32 44; UB0 9 22 23 32 44; UB1 9 22 23 32 44; UC0 9 22 23 32 44; UC1 9 22 23 32 44; UD0 9 22 23 32 44; UD1 9 22 23 32 44; UE0 9 22 23 32 44; UE1 9 22 23 32 44; USB1 7

## Via types
v1: diameter 0.406, hole 0.203, Top Layer to Bottom Layer, 405 vias
v2: diameter 0.355, hole 0.203, Top Layer to Bottom Layer, 453 vias
v3: diameter 1.016, hole 0.406, Top Layer to Bottom Layer, 16 vias

## Routing (per net, layer and track width the routed paths; a pad name or vN(x,y) marks a point on that pad's centre or on a via; arc(x,y) is an arc through that point)
+3V3: length 181.2
  Top Layer w0.508: v3(10.67,65.66) U4.1 ; v3(10.67,82.17) U4.24
  Top Layer w1.016: v3(88.39,65.66) 77.98,65.66 v3(77.04,66.6) U2.4 U2.2 85.05,69.98 C9.1
  Bottom Layer w0.508: v3(10.67,82.17) v3(10.67,65.66)
  Bottom Layer w1.016: v3(10.67,65.66) 76.1,65.66 v3(77.04,66.6) ; v3(88.39,65.66) 92.2,65.66 93.98,63.89 93.98,56.77 92.2,55 93.98,53.22 93.98,8.77 H2.3
+5V: length 104.3
  Top Layer w0.61: 80.77,82.64 80.72,82.59 70.09,82.59 69.2,83.48 69.2,86.02 70.06,86.87 D1.2
  Top Layer w0.686: 85.98,74.05 82.98,77.04 82.98,80.61 ; USB1.B9 82.98,80.61 ; 82.98,80.61 81.7,80.61 80.77,81.54 80.77,82.64 USB1.A9
  Top Layer w1.016: U2.3 84.22,72.28 85.98,74.05 88.47,74.05 89.41,73.1 C8.1 91.28,71.67 92.2,70.74 H1.1 93.98,58.3 93.98,13.97 92.2,12.2 H2.1
GND: length 2.4
  Bottom Layer w0.254: UB1.18 UB1.20 UB1.21
  vias: v1(19.94,35.94) v1(22.99,36.07) v1(24.89,44.96) v1(27.18,44.96) v1(27.18,43.46) v1(40.13,29.47) v1(40.13,28.45) v1(40.13,24.77) v1(40.26,24.39) v1(40.39,28.96) v1(40.39,27.94) v1(41.78,36.2) v1(42.29,36.2) v1(43.56,31.25) v1(44.32,36.33) v1(51.18,34.42) v1(52.71,33.79) v1(53.47,32.77) v1(53.72,31.12) v1(54.86,32.26) v1(59.44,33.79) v1(59.82,33.28) v1(62.1,34.55) v1(62.87,34.55) v1(77.34,50.42) v1(77.34,49.53) v1(78.23,50.42) v1(78.23,49.53) v1(85.09,33.91) v1(85.85,33.91) v1(85.85,33.15) v1(86.61,33.91) v1(86.61,33.15) v1(86.61,32.39) v2(2.54,93.98) v2(2.54,91.44) v2(2.54,88.9) v2(2.54,86.36) v2(2.54,63.5) v2(2.54,15.24) v2(2.54,12.7) v2(2.54,10.16) v2(2.54,7.62) v2(2.54,5.08) v2(2.54,2.54) v2(5.08,93.98) v2(5.08,91.44) v2(5.08,88.9) v2(5.08,86.36) v2(5.08,83.82) v2(5.08,78.74) v2(5.08,76.2) v2(5.08,60.96) v2(5.08,55.88) v2(5.08,53.34) v2(5.08,50.8) v2(5.08,38.1) v2(5.08,35.56) v2(5.08,33.02) v2(5.08,27.94) v2(5.08,12.7) v2(5.08,10.16) v2(5.08,7.62) v2(5.08,5.08) v2(5.08,2.54) v2(7.62,93.98) v2(7.62,91.44) v2(7.62,88.9) v2(7.62,86.36) v2(7.62,83.82) v2(7.62,81.28) v2(7.62,68.58) v2(7.62,66.04) v2(7.62,58.42) v2(7.62,55.88) v2(7.62,53.34) v2(7.62,20.32) v2(7.62,15.24) v2(7.62,12.7) v2(7.62,10.16) v2(7.62,7.62) v2(7.62,5.08) v2(7.62,2.54) v2(10.16,93.98) v2(10.16,91.44) v2(10.16,88.9) v2(10.16,86.36) v2(10.16,83.82) v2(10.16,60.96) v2(10.16,33.02) v2(10.16,15.24) v2(10.16,7.62) v2(10.16,5.08) v2(10.16,2.54) v2(12.7,93.98) v2(12.7,91.44) v2(12.7,88.9) v2(12.7,86.36) v2(12.7,83.82) v2(12.7,81.28) v2(12.7,60.96) v2(12.7,7.62) v2(12.7,5.08) v2(12.7,2.54) v2(15.24,93.98) v2(15.24,91.44) v2(15.24,88.9) v2(15.24,86.36) v2(15.24,83.82) v2(15.24,81.28) v2(15.24,73.66) v2(15.24,7.62) v2(15.24,5.08) v2(15.24,2.54) v2(17.78,93.98) v2(17.78,91.44) v2(17.78,88.9) v2(17.78,86.36) v2(17.78,83.82) v2(17.78,81.28) v2(17.78,71.12) v2(17.78,7.62) v2(17.78,5.08) v2(17.78,2.54) v2(20.32,93.98) v2(20.32,91.44) v2(20.32,88.9) v2(20.32,86.36) v2(20.32,83.82) v2(20.32,81.28) v2(20.32,76.2) v2(20.32,73.66) v2(20.32,71.12) v2(20.32,7.62) v2(20.32,5.08) v2(20.32,2.54) v2(22.86,93.98) v2(22.86,91.44) v2(22.86,88.9) v2(22.86,86.36) v2(22.86,83.82) v2(22.86,81.28) v2(22.86,76.2) v2(22.86,73.66) v2(22.86,71.12) v2(22.86,10.16) v2(22.86,7.62) v2(22.86,5.08) v2(22.86,2.54) v2(25.4,93.98) v2(25.4,91.44) v2(25.4,88.9) v2(25.4,86.36) v2(25.4,83.82) v2(25.4,81.28) v2(25.4,76.2) v2(25.4,73.66) v2(25.4,71.12) v2(25.4,10.16) v2(25.4,7.62) v2(25.4,5.08) v2(25.4,2.54) v2(27.94,93.98) v2(27.94,91.44) v2(27.94,88.9) v2(27.94,86.36) v2(27.94,83.82) v2(27.94,81.28) v2(27.94,78.74) v2(27.94,76.2) v2(27.94,73.66) v2(27.94,71.12) v2(27.94,68.58) v2(27.94,7.62) v2(27.94,5.08) v2(27.94,2.54) v2(30.48,93.98) v2(30.48,91.44) v2(30.48,88.9) v2(30.48,86.36) v2(30.48,83.82) v2(30.48,81.28) v2(30.48,78.74) v2(30.48,76.2) v2(30.48,73.66) v2(30.48,71.12) v2(30.48,68.58) v2(30.48,7.62) v2(30.48,5.08) v2(30.48,2.54) v2(33.02,93.98) v2(33.02,91.44) v2(33.02,88.9) v2(33.02,86.36) v2(33.02,83.82) v2(33.02,81.28) v2(33.02,78.74) v2(33.02,76.2) v2(33.02,73.66) v2(33.02,71.12) v2(33.02,68.58) v2(33.02,7.62) v2(33.02,5.08) v2(33.02,2.54) v2(35.56,93.98) v2(35.56,91.44) v2(35.56,88.9) v2(35.56,86.36) v2(35.56,83.82) v2(35.56,81.28) v2(35.56,78.74) v2(35.56,76.2) v2(35.56,73.66) v2(35.56,71.12) v2(35.56,68.58) v2(35.56,17.78) v2(35.56,7.62) v2(35.56,5.08) v2(35.56,2.54) v2(38.1,93.98) v2(38.1,91.44) v2(38.1,88.9) v2(38.1,86.36) v2(38.1,83.82) v2(38.1,81.28) v2(38.1,78.74) v2(38.1,76.2) v2(38.1,73.66) v2(38.1,71.12) v2(38.1,68.58) v2(38.1,7.62) v2(38.1,5.08) v2(38.1,2.54) v2(40.64,93.98) v2(40.64,91.44) v2(40.64,88.9) v2(40.64,86.36) v2(40.64,83.82) v2(40.64,81.28) v2(40.64,78.74) v2(40.64,76.2) v2(40.64,73.66) v2(40.64,71.12) v2(40.64,68.58) v2(40.64,7.62) v2(40.64,5.08) v2(40.64,2.54) v2(43.18,93.98) v2(43.18,91.44) v2(43.18,88.9) v2(43.18,86.36) v2(43.18,83.82) v2(43.18,81.28) v2(43.18,78.74) v2(43.18,76.2) v2(43.18,73.66) v2(43.18,71.12) v2(43.18,68.58) v2(43.18,7.62) v2(43.18,5.08) v2(43.18,2.54) v2(45.72,93.98) v2(45.72,91.44) v2(45.72,88.9) v2(45.72,86.36) v2(45.72,83.82) v2(45.72,81.28) v2(45.72,78.74) v2(45.72,76.2) v2(45.72,73.66) v2(45.72,71.12) v2(45.72,68.58) v2(45.72,7.62) v2(45.72,5.08) v2(45.72,2.54) v2(48.26,93.98) v2(48.26,91.44) v2(48.26,88.9) v2(48.26,86.36) v2(48.26,83.82) v2(48.26,81.28) v2(48.26,78.74) v2(48.26,76.2) v2(48.26,73.66) v2(48.26,71.12) v2(48.26,68.58) v2(48.26,53.34) v2(48.26,7.62) v2(48.26,5.08) v2(48.26,2.54) v2(50.8,93.98) v2(50.8,91.44) v2(50.8,88.9) v2(50.8,86.36) v2(50.8,83.82) v2(50.8,81.28) v2(50.8,78.74) v2(50.8,76.2) v2(50.8,73.66) v2(50.8,71.12) v2(50.8,68.58) v2(50.8,7.62) v2(50.8,5.08) v2(50.8,2.54) v2(53.34,93.98) v2(53.34,91.44) v2(53.34,88.9) v2(53.34,86.36) v2(53.34,83.82) v2(53.34,81.28) v2(53.34,78.74) v2(53.34,76.2) v2(53.34,73.66) v2(53.34,71.12) v2(53.34,68.58) v2(53.34,7.62) v2(53.34,5.08) v2(53.34,2.54) v2(55.88,93.98) v2(55.88,91.44) v2(55.88,88.9) v2(55.88,86.36) v2(55.88,83.82) v2(55.88,81.28) v2(55.88,78.74) v2(55.88,76.2) v2(55.88,73.66) v2(55.88,71.12) v2(55.88,68.58) v2(55.88,7.62) v2(55.88,5.08) v2(55.88,2.54) v2(58.42,93.98) v2(58.42,91.44) v2(58.42,88.9) v2(58.42,86.36) v2(58.42,83.82) v2(58.42,81.28) v2(58.42,68.58) v2(58.42,7.62) v2(58.42,5.08) v2(58.42,2.54) v2(60.96,93.98) v2(60.96,88.9) v2(60.96,76.2) v2(60.96,7.62) v2(60.96,5.08) v2(60.96,2.54) v2(63.5,93.98) v2(63.5,76.2) v2(63.5,68.58) v2(63.5,7.62) v2(63.5,5.08) v2(63.5,2.54) v2(66.04,93.98) v2(66.04,88.9) v2(66.04,83.82) v2(66.04,76.2) v2(66.04,68.58) v2(66.04,7.62) v2(66.04,5.08) v2(66.04,2.54) v2(68.58,91.44) v2(68.58,81.28) v2(68.58,78.74) v2(68.58,76.2) v2(68.58,71.12) v2(68.58,68.58) v2(68.58,10.16) v2(68.58,7.62) v2(68.58,5.08) v2(68.58,2.54) v2(71.12,88.9) v2(71.12,83.82) v2(71.12,76.2) v2(71.12,68.58) v2(71.12,50.8) v2(71.12,17.78) v2(71.12,15.24) v2(71.12,10.16) v2(71.12,7.62) v2(71.12,5.08) v2(71.12,2.54) v2(73.66,91.44) v2(73.66,88.9) v2(73.66,86.36) v2(73.66,83.82) v2(73.66,81.28) v2(73.66,71.12) v2(73.66,68.58) v2(73.66,17.78) v2(73.66,15.24) v2(73.66,5.08) v2(73.66,2.54) v2(76.2,93.98) v2(76.2,76.2) v2(76.2,73.66) v2(76.2,17.78) v2(76.2,15.24) v2(76.2,7.62) v2(76.2,5.08) v2(76.2,2.54) v2(78.74,93.98) v2(78.74,91.44) v2(78.74,88.9) v2(78.74,86.36) v2(78.74,83.82) v2(78.74,81.28) v2(78.74,78.74) v2(78.74,73.66) v2(78.74,63.5) v2(78.74,50.8) v2(78.74,17.78) v2(78.74,15.24) v2(78.74,7.62) v2(78.74,5.08) v2(78.74,2.54) v2(81.28,91.44) v2(81.28,88.9) v2(81.28,78.74) v2(81.28,76.2) v2(81.28,73.66) v2(81.28,71.12) v2(81.28,68.58) v2(81.28,63.5) v2(81.28,15.24) v2(81.28,7.62) v2(81.28,5.08) v2(81.28,2.54) v2(83.82,86.36) v2(83.82,73.66) v2(83.82,71.12) v2(83.82,63.5) v2(83.82,15.24) v2(83.82,7.62) v2(83.82,5.08) v2(83.82,2.54) v2(86.36,83.82) v2(86.36,76.2) v2(86.36,63.5) v2(86.36,55.88) v2(86.36,35.56) v2(86.36,22.86) v2(86.36,20.32) v2(86.36,15.24) v2(86.36,10.16) v2(86.36,7.62) v2(86.36,5.08) v2(86.36,2.54) v2(88.9,76.2) v2(88.9,63.5) v2(88.9,55.88) v2(88.9,53.34) v2(88.9,50.8) v2(88.9,17.78) v2(88.9,15.24) v2(88.9,12.7) v2(88.9,7.62) v2(88.9,5.08) v2(88.9,2.54) v2(91.44,76.2) v2(91.44,73.66) v2(91.44,53.34) v2(91.44,50.8) v2(91.44,48.26) v2(91.44,43.18) v2(91.44,40.64) v2(91.44,38.1) v2(91.44,35.56) v2(91.44,33.02) v2(91.44,30.48) v2(91.44,27.94) v2(91.44,25.4) v2(91.44,22.86) v2(91.44,20.32) v2(91.44,17.78) v2(91.44,15.24) v2(91.44,5.08) v2(91.44,2.54) v2(93.98,78.74) v2(93.98,76.2) v2(93.98,73.66) v2(93.98,71.12) v2(93.98,68.58) v2(93.98,66.04) v2(93.98,5.08) v2(93.98,2.54)
VDD: length 322.4
  Top Layer w1.016: v3(17.78,60.2) v3(36.07,60.2) v3(54.36,60.2) v3(72.64,60.2) 77.6,60.2 v3(79.88,62.49) 82.17,60.2 v3(88.39,60.2) ; D2.1 67.18,91.27 67.18,92.59 68.2,93.6 74.29,93.6 75.44,92.46 v3(75.44,86.87)
  Top Layer w1.27: D2.1 66.5,90.59 C3.1
  Bottom Layer w0.406: 34.94,23.79 36.03,23.79 37.21,24.97 37.21,43.95 36.03,45.13 ; 53.23,23.79 54.32,23.79 55.5,24.97 55.5,43.95 54.32,45.13 ; 36.03,45.13 34.94,45.13 ; 36.03,45.13 37.21,46.3 37.21,59.06 v3(36.07,60.2) ; v3(17.78,60.2) 18.92,59.06 18.92,46.3 17.75,45.13 ; v3(72.64,60.2) 73.79,59.06 73.79,46.3 72.61,45.13 ; 54.32,45.13 UB0.38 ; 54.32,45.13 55.5,46.3 55.5,59.06 v3(54.36,60.2) ; 90.9,45.13 92.07,46.3 92.07,51.82 89.53,54.36 89.53,59.06 v3(88.39,60.2) ; 90.9,45.13 92.07,43.95 92.07,24.97 90.9,23.79 89.81,23.79 ; 90.9,45.13 89.81,45.13 ; 72.61,45.13 73.79,43.95 73.79,24.97 72.61,23.79 71.52,23.79 ; 72.61,45.13 71.52,45.13 ; 17.75,45.13 18.92,43.95 18.92,24.97 17.75,23.79 UE0.38 ; 17.75,45.13 UA0.38
  Bottom Layer w1.016: v3(75.44,86.87) 75.44,80.52 79.88,76.08 v3(79.88,62.49)
VEE: length 300.9
  Top Layer w1.016: 64.92,63.9 D5.2 ; 64.92,63.9 66.33,62.49 v3(77.22,62.49) ; 64.92,63.9 63.5,62.49 v3(58.93,62.49) v3(40.64,62.49) v3(22.35,62.49) v3(4.06,62.49)
  Top Layer w1.27: D5.2 67.52,65.57 C2.2
  Bottom Layer w0.406: 41.76,22.19 40.67,22.19 39.5,23.37 39.5,42.42 40.6,43.53 ; 77.18,43.53 UC0.16 ; 77.18,43.53 76.07,44.63 76.07,61.34 v3(77.22,62.49) ; 77.18,43.53 76.07,42.42 76.07,23.37 77.25,22.19 78.34,22.19 ; 40.6,43.53 41.76,43.53 ; 40.6,43.53 39.5,44.63 39.5,61.34 v3(40.64,62.49) ; UE0.16 4.1,22.19 2.92,23.37 2.92,42.42 4.03,43.53 ; 4.03,43.53 UA0.16 ; 4.03,43.53 2.92,44.63 2.92,61.34 v3(4.06,62.49) ; 58.89,43.53 57.78,42.42 57.78,23.37 58.96,22.19 UD1.16 ; 58.89,43.53 UB1.16 ; 58.89,43.53 57.78,44.63 57.78,61.34 v3(58.93,62.49) ; 22.31,43.53 21.21,44.63 21.21,61.34 v3(22.35,62.49) ; 22.31,43.53 21.21,42.42 21.21,23.37 22.39,22.19 UE1.16 ; 22.31,43.53 UA1.16
0: length 32.9
  Top Layer w0.254: NOREF#70.0 10.92,49.15 11.3,49.53 v1(16,49.53)
  Inner2 w0.254: v1(16,49.53) v1(34.29,49.53)
  Bottom Layer w0.254: UA0.33 15.45,49.53 v1(16,49.53) ; v1(34.29,49.53) 33.74,49.53 UA1.33
1: length 31.9
  Top Layer w0.254: v1(14.73,45.85) 13.46,44.58 NOREF#13.1
  Inner2 w0.254: v1(32.51,45.85) 32.26,46.11 14.99,46.11 v1(14.73,45.85)
  Bottom Layer w0.254: v1(32.51,45.85) 32.13,45.85 31.62,46.36 31.62,46.99 32.16,47.53 34.94,47.53 ; UA0.35 14.38,47.53 13.97,47.12 13.97,46.25 14.37,45.85 v1(14.73,45.85)
2: length 26.4
  Top Layer w0.254: NOREF#63.2 16,43.82 v1(14.73,45.09)
  Inner2 w0.254: v1(14.73,45.09) 15.24,45.6 32,45.6 v1(32.51,45.09)
  Bottom Layer w0.254: v1(14.73,45.09) 14.99,45.09 15.82,45.93 16.66,45.93 ; v1(32.51,45.09) 33.27,45.09 34.11,45.93 34.94,45.93
3: length 24.6
  Top Layer w0.254: v1(19.81,44.33) 18.54,43.06 NOREF#87.3
  Inner2 w0.254: v1(14.73,44.33) v1(19.81,44.33) v1(32.51,44.33)
  Bottom Layer w0.254: UA0.39 v1(14.73,44.33) ; v1(32.51,44.33) 34.94,44.33
4: length 54.1
  Top Layer w0.254: v1(24.38,34.29) 23.88,33.79 21.59,33.79 21.08,34.29 NOREF#75.4
  Inner2 w0.254: v1(6.1,34.29) v1(24.38,34.29)
  Bottom Layer w0.254: UA1.17 25.02,44.33 25.53,43.82 25.53,40.77 24.38,39.63 v1(24.38,34.29) ; v1(6.1,34.29) 6.1,39.5 6.98,40.39 6.98,43.44 6.1,44.33 UA0.17
5: length 45.7
  Top Layer w0.254: NOREF#83.5 23.62,36.2 v1(23.88,35.94)
  Inner2 w0.254: v1(21.84,34.8) v1(3.56,34.8)
  Bottom Layer w0.254: v1(23.88,35.94) 22.73,34.8 v1(21.84,34.8) 21.84,42.06 22.51,42.73 UA1.15 ; UA0.15 4.24,42.73 3.56,42.04 v1(3.56,34.8)
6: length 37.9
  Top Layer w0.254: v1(22.35,39.88) 22.35,48.14 22.99,48.77 24.89,48.77 26.16,47.5 NOREF#59.6
  Inner2 w0.254: v1(6.22,41.15) 7.49,39.88 v1(22.35,39.88)
  Bottom Layer w0.254: UA1.13 22.51,41.13 22.35,40.97 v1(22.35,39.88) ; v1(6.22,41.15) 6.2,41.13 UA0.13
7: length 34.6
  Top Layer w0.254: NOREF#33.7 28.7,37.6 v1(26.92,35.82)
  Inner2 w0.254: v1(6.73,35.31) 26.42,35.31 v1(26.92,35.82)
  Bottom Layer w0.254: v1(6.73,35.31) 6.92,35.5 UA0.11 ; v1(26.92,35.82) 25.21,37.53 UA1.11
8: length 49.3
  Top Layer w0.254: v1(53.21,50.17) 53.06,50.02 33.5,50.02 31.24,47.76 NOREF#111.8
  Inner2 w0.254: v1(70.87,49.53) 53.85,49.53 v1(53.21,50.17)
  Bottom Layer w0.254: UB0.33 51.6,50.17 v1(53.21,50.17) ; v1(70.87,49.53) 70.31,49.53 UB1.33
9: length 49.7
  Top Layer w0.254: NOREF#25.9 33.78,47.63 35.69,49.53 53.72,49.53 v1(54.36,48.9)
  Inner2 w0.254: v1(72.64,48.9) v1(54.36,48.9)
  Bottom Layer w0.254: UB0.35 54,47.53 54.36,47.88 v1(54.36,48.9) ; v1(72.64,48.9) 72.64,47.88 72.29,47.53 71.52,47.53
10: length 56.5
  Top Layer w0.254: NOREF#54.10 v1(36.32,48.9)
  Inner1 w0.254: v1(36.32,48.9) 38.99,51.57 47.5,51.57 48.51,52.58 v1(49.02,52.58)
  Inner2 w0.254: v1(72.64,50.17) v1(54.86,50.17)
  Bottom Layer w0.254: 53.23,45.93 54.19,45.93 54.86,46.6 v1(54.86,50.17) 53.47,51.57 50.04,51.57 v1(49.02,52.58) ; 71.52,45.93 72.47,45.93 73.15,46.61 73.15,49.28 72.64,49.79 v1(72.64,50.17)
11: length 67
  Top Layer w0.254: NOREF#29.11 38.86,34.04 39.62,33.28 51.05,33.28 51.56,32.77 52.58,32.77 v1(54.23,34.42)
  Inner2 w0.254: v1(73.15,34.42) 72.52,35.06 54.86,35.06 v1(54.23,34.42)
  Bottom Layer w0.254: v1(73.15,34.42) 73.15,43.69 72.52,44.33 71.52,44.33 ; UB0.39 54.19,44.33 54.86,43.66 54.86,35.06 v1(54.23,34.42)
12: length 39.4
  Top Layer w0.254: NOREF#73.12 41.4,47.76 v1(40.26,48.9)
  Inner2 w0.254: v1(58.55,50.8) 52.83,50.8 51.56,49.53 40.89,49.53 v1(40.26,48.9)
  Bottom Layer w0.254: v1(58.55,50.8) 58.55,44.87 59.09,44.33 UB1.17 ; 41.76,44.33 40.8,44.33 40.26,44.87 v1(40.26,48.9)
13: length 40.8
  Top Layer w0.254: v1(42.8,36.45) 43.94,37.6 NOREF#100.13
  Inner2 w0.254: v1(58.42,33.79) 53.97,33.79 53.34,34.42 51.94,34.42 50.55,35.82 43.43,35.82 v1(42.8,36.45)
  Bottom Layer w0.254: v1(42.8,36.45) 42.8,39.63 43.05,39.88 43.05,42.4 42.72,42.73 41.76,42.73 ; UB1.15 59.09,42.73 58.42,42.06 v1(58.42,33.79)
14: length 49.1
  Top Layer w0.254: v1(40.13,36.07) 40.13,35.94 41.02,35.06 44.96,35.06 46.48,36.58 NOREF#103.14
  Inner2 w0.254: v1(58.93,33.28) v1(54.23,33.28)
  Bottom Layer w0.254: v1(54.23,33.28) 51.69,35.82 48.39,35.82 47.62,35.06 41.02,35.06 40.13,35.94 v1(40.13,36.07) 40.13,40.39 40.87,41.13 41.76,41.13 ; v1(58.93,33.28) 58.94,33.29 58.94,41.03 59.04,41.13 UB1.13
15: length 57.7
  Top Layer w0.254: NOREF#91.15 49.02,36.58 50.55,35.06 54.61,35.06 55.12,34.55 v1(61.21,34.55)
  Inner1 w0.254: v1(40.77,36.2) 40.77,32.39 41.4,31.75 v1(41.4,31.25)
  Inner2 w0.254: v1(61.21,34.55) 62.1,33.66 62.1,33.15 61.72,32.77 54.23,32.77 52.71,31.25 50.67,31.25 50.16,30.74 41.91,30.74 v1(41.4,31.25)
  Bottom Layer w0.254: UB0.11 43.5,36.14 42.93,35.56 41.4,35.56 v1(40.77,36.2) ; v1(61.21,34.55) 61.79,35.12 UB1.11
16: length 75.6
  Top Layer w0.254: NOREF#6.16 51.56,48.39 v1(52.07,48.9)
  Inner1 w0.254: v1(52.2,53.6) 52.2,49.03 v1(52.07,48.9) ; v1(89.53,27.91) v1(89.53,49.28)
  Inner2 w0.254: v1(88.14,53.09) 87.63,53.6 v1(52.2,53.6)
  Bottom Layer w0.254: v1(89.53,49.28) 88.86,49.28 UC0.33 88.07,53.03 v1(88.14,53.09) ; v1(89.53,27.91) 88.86,27.91 88.07,28.69
17: length 69.7
  Top Layer w0.254: v1(87.63,47.5) 87.63,48.64 85.98,50.3 82.17,50.3 79.88,52.58 58.29,52.58 56.13,50.42 56.13,49.53 54.1,47.5 NOREF#49.17
  Inner1 w0.254: v1(87.63,26.17) v1(87.63,47.5)
  Bottom Layer w0.254: 89.81,26.19 87.66,26.19 v1(87.63,26.17) ; v1(87.63,47.5) 87.66,47.53 89.81,47.53
18: length 68.1
  Top Layer w0.254: NOREF#21.18 56.64,50.3 58.42,52.07 79.63,52.07 81.91,49.79 85.72,49.79 87,48.52 87,47.12 v1(88.26,45.85)
  Inner1 w0.254: v1(88.26,24.51) v1(88.26,45.85)
  Bottom Layer w0.254: 89.81,45.93 88.34,45.93 v1(88.26,45.85) ; v1(88.26,24.51) 89.73,24.51 89.81,24.59
19: length 66.2
  Top Layer w0.254: NOREF#55.19 59.18,50.68 60.07,51.57 79.38,51.57 81.66,49.28 85.34,49.28 85.72,48.9 85.72,45.98 87.38,44.33 v1(88.9,44.33)
  Inner1 w0.254: v1(88.9,22.99) v1(88.9,44.33)
  Bottom Layer w0.254: 89.81,22.99 v1(88.9,22.99) ; v1(88.9,44.33) 89.81,44.33
20: length 51.1
  Top Layer w0.254: v1(79.63,34.42) 78.99,35.06 67.31,35.06 62.99,30.74 60.83,30.74 59.18,29.09 NOREF#42.20
  Inner1 w0.254: v1(80.01,16.39) 79.63,16.77 v1(79.63,34.42)
  Bottom Layer w0.254: 80.07,17.26 80.07,16.45 v1(80.01,16.39) ; UC0.11 80.07,37.53 79.63,37.09 v1(79.63,34.42)
21: length 57.2
  Top Layer w0.254: v1(80.26,34.8) 79.5,35.56 67.06,35.56 62.74,31.25 60.58,31.25 60.07,30.74 58.29,30.74 56.64,29.09 NOREF#58.21
  Inner1 w0.254: v1(80.9,44.33) 80.26,43.69 v1(80.26,34.8) 80.26,25.15 v1(80.9,24.51)
  Bottom Layer w0.254: v1(80.9,24.51) 79.38,22.99 78.34,22.99 ; v1(80.9,44.33) UC0.17
22: length 64.5
  Top Layer w0.254: v1(81.15,34.8) 79.88,36.07 66.8,36.07 62.48,31.75 60.32,31.75 59.82,31.25 55.63,31.25 54.1,29.72 NOREF#52.22
  Inner1 w0.254: v1(80.9,43.44) 80.9,35.06 v1(81.15,34.8) 80.9,34.55 80.9,27.31 81.53,26.67 81.53,24.26 80.9,23.63 v1(80.9,20.71)
  Bottom Layer w0.254: v1(80.9,43.44) 80.19,42.73 UC0.15 ; 78.34,21.39 80.21,21.39 v1(80.9,20.71)
23: length 59
  Top Layer w0.254: v1(62.87,33.79) 62.87,32.9 62.23,32.26 60.07,32.26 59.56,31.75 53.59,31.75 51.56,29.72 NOREF#84.23
  Inner1 w0.254: v1(62.87,33.79) 65.53,33.79 66.8,35.06 76.33,35.06 v1(76.96,34.42) 75.69,33.15 v1(75.69,20.07)
  Bottom Layer w0.254: v1(76.96,34.42) 76.96,40.77 77.32,41.13 UC0.13 ; v1(75.69,20.07) 75.97,19.79 78.34,19.79
24: length 36.4
  Top Layer w0.254: NOREF#39.24 49.02,29.72 50.55,31.25 52.32,31.25 52.83,31.75 v1(52.83,32.26)
  Inner1 w0.254: v1(52.83,32.26) v1(52.83,29.34)
  Inner2 w0.254: v1(70.61,29.34) v1(52.83,29.34)
  Bottom Layer w0.254: v1(70.61,29.34) 70.61,29.72 70.38,29.96 70.02,29.96 69.79,29.72 UD1.33 ; v1(52.83,29.34) 52.83,29.77 52.5,30.1 51.82,30.1 51.5,29.78 51.5,28.73
25: length 49.1
  Top Layer w0.254: v1(52.58,27.94) 52.58,18.55 51.69,17.66 48.39,17.66 46.48,19.56 NOREF#3.25
  Inner2 w0.254: v1(52.58,27.94) v1(70.61,27.94)
  Bottom Layer w0.254: v1(52.58,27.94) 54.1,27.94 54.48,27.56 54.48,26.48 54.19,26.19 53.23,26.19 ; 71.52,26.19 72.48,26.19 72.77,26.48 72.77,27.56 72.39,27.94 v1(70.61,27.94)
26: length 58.5
  Top Layer w0.254: v1(53.09,28.58) 53.09,18.29 51.94,17.15 45.09,17.15 43.94,18.29 NOREF#48.26
  Inner2 w0.254: v1(53.09,28.58) v1(70.61,28.58)
  Bottom Layer w0.254: v1(70.61,28.58) 72.48,28.58 73.24,27.82 73.24,25.39 72.45,24.59 71.49,24.59 ; 53.23,24.59 54.19,24.59 54.99,25.39 54.99,27.82 54.23,28.58 v1(53.09,28.58)
27: length 54.9
  Top Layer w0.254: v1(54.48,16.64) 53.59,15.75 42.42,15.75 41.4,16.77 NOREF#85.27
  Inner2 w0.254: v1(72.77,16.64) v1(54.48,16.64)
  Bottom Layer w0.254: v1(54.48,16.64) 54.48,22.7 54.19,22.99 53.23,22.99 ; 71.52,22.99 72.48,22.99 72.77,22.7 v1(72.77,16.64)
28: length 43.3
  Top Layer w0.254: v1(45.21,24.51) 45.21,30.36 44.83,30.74 39.88,30.74 38.86,29.72 NOREF#19.28
  Inner2 w0.254: v1(62.99,24.51) v1(45.21,24.51)
  Bottom Layer w0.254: v1(45.21,24.51) 43.69,22.99 41.76,22.99 ; v1(62.99,24.51) 61.47,22.99 UD1.17
29: length 40
  Top Layer w0.254: NOREF#38.29 36.32,17.91 37.08,17.15 v1(39.5,17.15)
  Inner2 w0.254: v1(39.5,17.15) v1(57.78,17.15)
  Bottom Layer w0.254: UD1.15 59.11,21.39 57.78,20.07 v1(57.78,17.15) ; v1(39.5,17.15) 39.5,20.07 40.77,21.34 41.71,21.34 41.76,21.39
30: length 39.9
  Top Layer w0.254: NOREF#2.30 33.78,17.66 35.05,16.39 39.75,16.39 40.26,16.9 v1(40.26,17.66)
  Inner2 w0.254: v1(58.55,17.66) v1(40.26,17.66)
  Bottom Layer w0.254: v1(58.55,17.66) 58.55,19.25 59.09,19.79 UD1.13 ; 41.73,19.79 40.77,19.79 40.26,19.28 v1(40.26,17.66)
31: length 42.4
  Top Layer w0.254: v1(40.77,16.39) 40.13,15.75 32.89,15.75 31.24,17.4 NOREF#35.31
  Inner2 w0.254: v1(42.04,18.16) v1(60.32,18.16)
  Bottom Layer w0.254: v1(60.32,18.16) 60.88,18.16 UD1.11 ; 43.5,17.26 42.59,18.16 v1(42.04,18.16) 42.04,16.9 41.53,16.39 v1(40.77,16.39)
32: length 52.1
  Top Layer w0.254: v1(31.24,13.21) 30.35,13.21 28.7,14.86 NOREF#40.32
  Inner1 w0.254: v1(35.05,28.73) 35.05,17.02 v1(31.24,13.21)
  Inner2 w0.254: v1(35.05,28.73) v1(17.27,28.73)
  Bottom Layer w0.254: v1(17.27,28.73) UE0.33 ; UE1.33 v1(35.05,28.73)
33: length 35.9
  Top Layer w0.254: NOREF#93.33 26.16,24.77 v1(24.77,26.17)
  Inner2 w0.254: v1(9.27,26.17) v1(24.77,26.17)
  Bottom Layer w0.254: 34.94,26.19 32.28,26.19 31.37,25.28 25.65,25.28 v1(24.77,26.17) ; v1(9.27,26.17) 16.63,26.17 UE0.35
34: length 51.4
  Top Layer w0.254: NOREF#77.34 23.62,29.72 22.1,31.25 12.7,31.25 12.19,30.74 v1(12.19,24.51)
  Inner2 w0.254: v1(12.19,24.51) 12.83,23.88 28.83,23.88 29.46,24.51 v1(32.51,24.51)
  Bottom Layer w0.254: 34.94,24.59 32.59,24.59 v1(32.51,24.51) ; UE0.37 12.27,24.59 v1(12.19,24.51)
35: length 22.2
  Top Layer w0.254: NOREF#101.35 21.08,23.88 v1(19.81,22.61)
  Inner2 w0.254: v1(27.43,22.61) v1(19.81,22.61)
  Bottom Layer w0.254: 34.94,22.99 32.89,22.99 31.24,21.34 28.7,21.34 v1(27.43,22.61) ; v1(19.81,22.61) 19.43,22.99 UE0.39
36: length 35.7
  Top Layer w0.254: NOREF#41.36 18.54,18.55 18.92,18.16 21.97,18.16 22.35,18.55 v1(22.35,23.25)
  Inner2 w0.254: v1(4.06,23.25) v1(22.35,23.25)
  Bottom Layer w0.254: v1(4.06,23.25) 4.32,22.99 UE0.17 ; v1(22.35,23.25) 22.61,22.99 UE1.17
37: length 41.5
  Top Layer w0.254: v1(21.21,17.53) 16.38,17.53 16,17.91 NOREF#46.37
  Inner2 w0.254: v1(21.21,17.53) v1(3.56,17.53)
  Bottom Layer w0.254: UE1.15 21.89,21.39 21.21,20.71 v1(21.21,17.53) ; UE0.15 3.61,21.39 2.92,20.71 2.92,18.16 v1(3.56,17.53)
38: length 42.6
  Top Layer w0.254: v1(6.73,21.97) 6.73,18.16 7.37,17.53 12.95,17.53 13.46,18.04 NOREF#9.38
  Inner2 w0.254: v1(6.73,21.97) v1(24.89,21.97)
  Bottom Layer w0.254: UE1.13 24.44,19.79 24.89,20.25 v1(24.89,21.97) ; UE0.13 6.33,19.79 6.73,20.2 v1(6.73,21.97)
39: length 32.3
  Top Layer w0.254: NOREF#90.39 8.89,22.61 6.22,22.61 5.46,21.85 v1(5.46,18.16)
  Inner2 w0.254: v1(5.46,18.16) v1(23.75,18.16)
  Bottom Layer w0.254: UE0.11 6.01,18.16 v1(5.46,18.16) ; v1(23.75,18.16) 24.3,18.16 UE1.11
AB0: length 39.5
  Inner2 w0.254: v1(49.78,51.06) 48.77,50.04 14.22,50.04 v1(13.21,49.03)
  Bottom Layer w0.254: UA0.31 13.32,49.14 v1(13.21,49.03) ; v1(49.78,51.06) 49.9,50.94 UB0.31
AB1: length 39.5
  Inner2 w0.254: v1(12.45,49.03) 13.97,50.55 48.51,50.55 v1(49.02,51.06)
  Bottom Layer w0.254: UA0.30 12.52,49.1 v1(12.45,49.03) ; v1(49.02,51.06) 49.1,50.98 UB0.30
AB2: length 39.5
  Inner2 w0.254: v1(11.68,49.03) 13.72,51.06 v1(48.26,51.06)
  Bottom Layer w0.254: UB0.29 48.3,51.02 v1(48.26,51.06) ; v1(11.68,49.03) 11.72,49.06 UA0.29
AB3: length 41.1
  Inner2 w0.254: v1(11.68,52.58) v1(47.37,52.58)
  Bottom Layer w0.254: UA0.28 10.92,51.82 v1(11.68,52.58) ; v1(47.37,52.58) 47.5,52.45 UB0.28
AB4: length 42.1
  Inner2 w0.254: v1(46.61,53.09) v1(10.92,53.09)
  Bottom Layer w0.254: UB0.27 46.7,53 v1(46.61,53.09) ; UA0.27 10.12,52.29 v1(10.92,53.09)
AB5: length 43.1
  Inner2 w0.254: v1(10.16,53.6) v1(45.85,53.6)
  Bottom Layer w0.254: UA0.26 9.32,52.76 v1(10.16,53.6) ; UB0.26 45.9,53.55 v1(45.85,53.6)
AB6: length 44.4
  Inner2 w0.254: v1(50.16,39.88) 48.9,38.61 13.84,38.61 12.83,37.6 12.83,36.58 12.57,36.33 v1(12.19,36.33)
  Bottom Layer w0.254: v1(50.16,39.88) 49.91,39.63 49.91,38.61 UB0.3 ; v1(12.19,36.33) 12.57,36.33 13.32,37.08 UA0.3
AB7: length 41.4
  Inner2 w0.254: v1(12.19,36.96) 12.19,37.72 13.59,39.12 44.32,39.12 v1(45.09,39.88)
  Bottom Layer w0.254: UB0.4 49.1,39.55 48.77,39.88 v1(45.09,39.88) ; v1(12.19,36.96) 12.52,37.29 UA0.4
AC0: length 90.2
  Inner1 w0.254: v1(86.36,42.04) 85.85,42.04 85.6,42.3 85.6,50.3 v1(86.36,51.06)
  Inner2 w0.254: v1(86.36,42.04) 86.23,41.91 12.95,41.91 v1(12.19,42.68)
  Bottom Layer w0.254: v1(12.19,42.68) 12.7,42.17 12.7,40.52 11.72,39.54 UA0.5 ; v1(86.36,51.06) 86.47,50.94 UC0.31
AC1: length 89.9
  Inner1 w0.254: v1(85.6,51.06) 85.09,50.55 85.09,42.17 85.85,41.41 v1(86.36,41.41)
  Inner2 w0.254: v1(12.19,41.91) 12.7,41.41 v1(86.36,41.41)
  Bottom Layer w0.254: v1(85.6,51.06) 85.67,50.98 UC0.30 ; v1(12.19,41.91) 12.19,40.77 10.92,39.5 UA0.6
AC2: length 92.7
  Inner1 w0.254: v1(86.36,40.77) 85.85,40.77 84.58,42.04 84.58,50.8 v1(84.84,51.06)
  Inner2 w0.254: v1(9.4,41.15) 9.91,41.15 10.16,40.9 85.72,40.9 85.85,40.77 v1(86.36,40.77)
  Bottom Layer w0.254: UC0.29 84.87,51.02 v1(84.84,51.06) ; UA0.7 10.12,40.94 9.91,41.15 v1(9.4,41.15)
AC3: length 92.1
  Inner1 w0.254: v1(84.07,51.06) 84.07,41.91 85.85,40.14 v1(86.36,40.14)
  Inner2 w0.254: v1(9.4,40.39) 85.6,40.39 85.85,40.14 v1(86.36,40.14)
  Bottom Layer w0.254: UA0.8 9.32,40.31 v1(9.4,40.39) ; v1(84.07,51.06) UC0.28
AC4: length 79.8
  Inner2 w0.254: v1(7.75,52.07) v1(83.19,52.07)
  Bottom Layer w0.254: v1(83.19,52.07) 83.27,51.98 UC0.27 ; v1(7.75,52.07) 8.52,51.3 UA0.25
AC5: length 78.8
  Inner2 w0.254: v1(82.42,51.57) v1(6.98,51.57)
  Bottom Layer w0.254: UC0.26 82.47,51.52 v1(82.42,51.57) ; 7.72,50.03 7.72,50.83 v1(6.98,51.57)
AC6: length 75.3
  Inner2 w0.254: v1(86.36,36.96) 86.36,37.6 85.85,38.1 16.76,38.1 16.38,37.72 v1(14.73,37.72)
  Bottom Layer w0.254: UA0.1 14.92,37.91 v1(14.73,37.72) ; v1(86.36,36.96) 86.47,37.08 UC0.3
AC7: length 75.4
  Inner2 w0.254: v1(85.72,36.96) 85.72,37.47 85.6,37.6 17.02,37.6 16.51,37.09 v1(14.73,37.09)
  Bottom Layer w0.254: v1(14.73,37.09) 14.35,37.09 14.12,37.32 UA0.2 ; UC0.4 85.67,37.01 v1(85.72,36.96)
AD0: length 43.7
  Inner1 w0.254: v1(31.5,31.75) v1(31.5,48.9)
  Inner2 w0.254: v1(52.07,31.75) v1(31.5,31.75)
  Bottom Layer w0.254: v1(52.07,31.75) 50.55,31.75 49.9,31.11 49.9,28.73 ; UA1.31 31.61,49.01 v1(31.5,48.9)
AD1: length 44.5
  Inner1 w0.254: v1(30.73,31.75) v1(30.73,48.9)
  Inner2 w0.254: v1(51.31,32.26) 51.28,32.24 31.22,32.24 v1(30.73,31.75)
  Bottom Layer w0.254: v1(51.31,32.26) 49.78,32.26 49.1,31.58 49.1,28.73 ; UA1.30 30.81,48.97 v1(30.73,48.9)
AD2: length 45.2
  Inner1 w0.254: v1(29.97,31.75) v1(29.97,48.9)
  Inner2 w0.254: v1(50.55,32.77) 30.99,32.77 v1(29.97,31.75)
  Bottom Layer w0.254: 48.3,28.73 48.3,32.05 49.02,32.77 v1(50.55,32.77) ; UA1.29 30.01,48.94 v1(29.97,48.9)
AD3: length 50.5
  Inner1 w0.254: v1(29.21,31.75) v1(29.21,48.9)
  Inner2 w0.254: v1(52.07,33.28) 30.73,33.28 v1(29.21,31.75)
  Bottom Layer w0.254: 47.5,28.73 47.5,32.52 48.26,33.28 v1(52.07,33.28) ; v1(29.21,48.9) UA1.28
AD4: length 51.3
  Inner1 w0.254: v1(28.45,31.75) v1(28.45,48.9)
  Inner2 w0.254: v1(28.45,31.75) 30.48,33.79 v1(51.31,33.79)
  Bottom Layer w0.254: UA1.27 28.41,48.94 v1(28.45,48.9) ; v1(51.31,33.79) 47.37,33.79 46.7,33.11 46.7,28.73
AD5: length 52.1
  Inner1 w0.254: v1(27.69,31.75) v1(27.69,48.9)
  Inner2 w0.254: v1(27.69,31.75) 30.23,34.29 v1(50.55,34.29)
  Bottom Layer w0.254: UA1.26 27.61,48.97 v1(27.69,48.9) ; v1(50.55,34.29) 46.48,34.29 45.9,33.71 45.9,28.73
AD6: length 41
  Inner1 w0.254: v1(49.53,35.31) 49.53,34.42 49.28,34.17 49.28,17.02 v1(49.91,16.39)
  Inner2 w0.254: v1(49.53,35.31) v1(33.15,35.31)
  Bottom Layer w0.254: v1(49.91,16.39) 49.9,16.4 49.9,17.26 ; v1(33.15,35.31) 32.26,35.31 31.61,35.96 UA1.3
AD7: length 40.7
  Inner1 w0.254: v1(48.77,34.8) 48.77,16.77 v1(49.15,16.39)
  Inner2 w0.254: v1(48.77,34.8) v1(32.38,34.8)
  Bottom Layer w0.254: UA1.4 30.81,35.74 31.75,34.8 v1(32.38,34.8) ; 49.1,17.26 49.1,16.44 v1(49.15,16.39)
AE0: length 24.8
  Inner2 w0.254: v1(26.92,32.26) 26.91,32.25 v1(13.32,32.25)
  Bottom Layer w0.254: UA1.5 30.01,35.35 v1(26.92,32.26) ; UE0.31 v1(13.32,32.25) 13.33,32.26
AE1: length 25
  Inner2 w0.254: v1(26.92,33.02) 26.67,32.77 v1(12.57,32.77)
  Bottom Layer w0.254: UA1.6 29.21,35.31 v1(26.92,33.02) ; UE0.30 12.52,32.72 v1(12.57,32.77)
AE2: length 25.4
  Inner2 w0.254: v1(11.72,33.28) 26.42,33.28 v1(26.92,33.79)
  Bottom Layer w0.254: v1(26.92,33.79) 28.41,35.27 UA1.7 ; v1(11.72,33.28) UE0.29
AE3: length 25.7
  Inner2 w0.254: v1(10.92,33.79) 26.16,33.79 v1(26.92,34.55)
  Bottom Layer w0.254: v1(10.92,33.79) UE0.28 ; UA1.8 27.61,35.23 v1(26.92,34.55)
AE4: length 37.5
  Inner1 w0.254: v1(26.8,48.9) 26.8,48.64 26.29,48.14 26.29,32.01 v1(26.03,31.75)
  Inner2 w0.254: v1(26.03,31.75) v1(10.16,31.75)
  Bottom Layer w0.254: v1(26.8,48.9) 26.81,48.91 UA1.25 ; v1(10.16,31.75) 10.12,31.72 UE0.27
AE5: length 37.6
  Inner1 w0.254: v1(25.15,31.25) 25.53,31.63 25.53,48.39 v1(26.03,48.9)
  Inner2 w0.254: v1(9.27,31.25) v1(25.15,31.25)
  Bottom Layer w0.254: v1(9.27,31.25) 9.32,31.19 UE0.26 ; v1(26.03,48.9) 26.01,48.92 UA1.24
AE6: length 43.1
  Inner1 w0.254: v1(13.39,15.75) 14.73,17.1 v1(14.73,35.82)
  Inner2 w0.254: v1(14.73,35.82) 16.76,35.82 17.53,36.58 32.13,36.58 v1(32.38,36.33)
  Bottom Layer w0.254: UA1.1 33.21,36.77 32.77,36.33 v1(32.38,36.33) ; v1(13.39,15.75) 13.32,15.82 UE0.3
AE7: length 43.7
  Inner1 w0.254: v1(12.5,15.24) 12.5,15.93 13.97,17.4 v1(13.97,35.82)
  Inner2 w0.254: v1(32.38,37.09) 17.27,37.09 16.64,36.45 14.61,36.45 v1(13.97,35.82)
  Bottom Layer w0.254: v1(12.5,15.24) 12.52,15.27 UE0.4 ; UA1.2 32.41,37.11 v1(32.38,37.09)
BC0: length 42.8
  Inner2 w0.254: v1(52.83,36.96) 53.34,36.96 53.47,37.09 83.44,37.09 84.84,35.69 v1(84.84,35.06)
  Bottom Layer w0.254: UC0.5 84.87,35.09 v1(84.84,35.06) ; UB0.5 48.3,37.3 48.64,36.96 v1(52.83,36.96)
BC1: length 42.8
  Inner2 w0.254: v1(52.83,36.33) 53.47,36.33 53.72,36.58 82.93,36.58 84.07,35.44 v1(84.07,35.06)
  Bottom Layer w0.254: v1(84.07,35.06) UC0.6 ; v1(52.83,36.33) 48.39,36.33 47.5,37.22 UB0.6
BC2: length 46.1
  Inner2 w0.254: v1(83.31,35.06) 82.14,35.06 81.63,35.56 54.36,35.56 53.85,35.06 52.07,35.06 50.8,36.33 v1(45.09,36.33)
  Bottom Layer w0.254: UC0.7 83.27,35.09 v1(83.31,35.06) ; UB0.7 46.7,37.18 45.85,36.33 v1(45.09,36.33)
